# Altium project T-USB BQ10.PrjPcb (part 1 of 2)
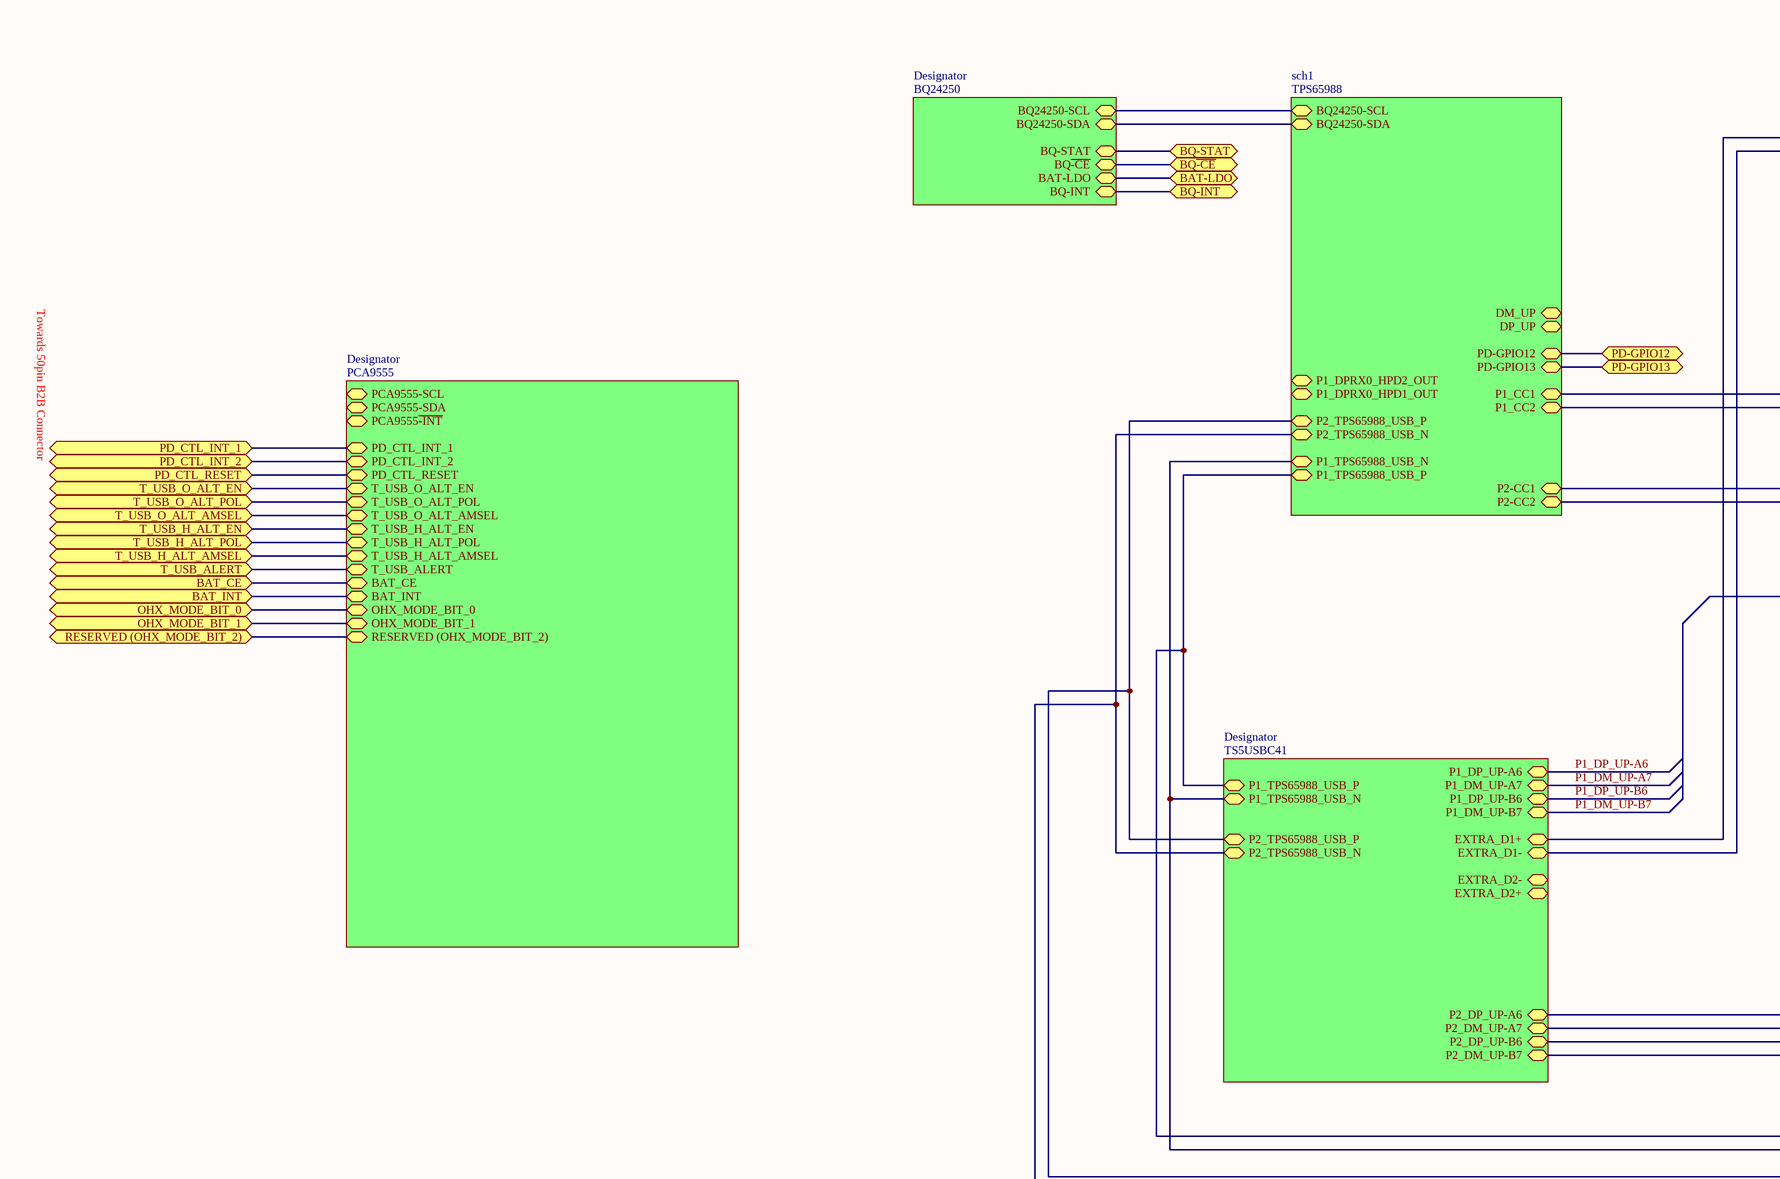
[diagram p0: System Block.SchDoc, top left]
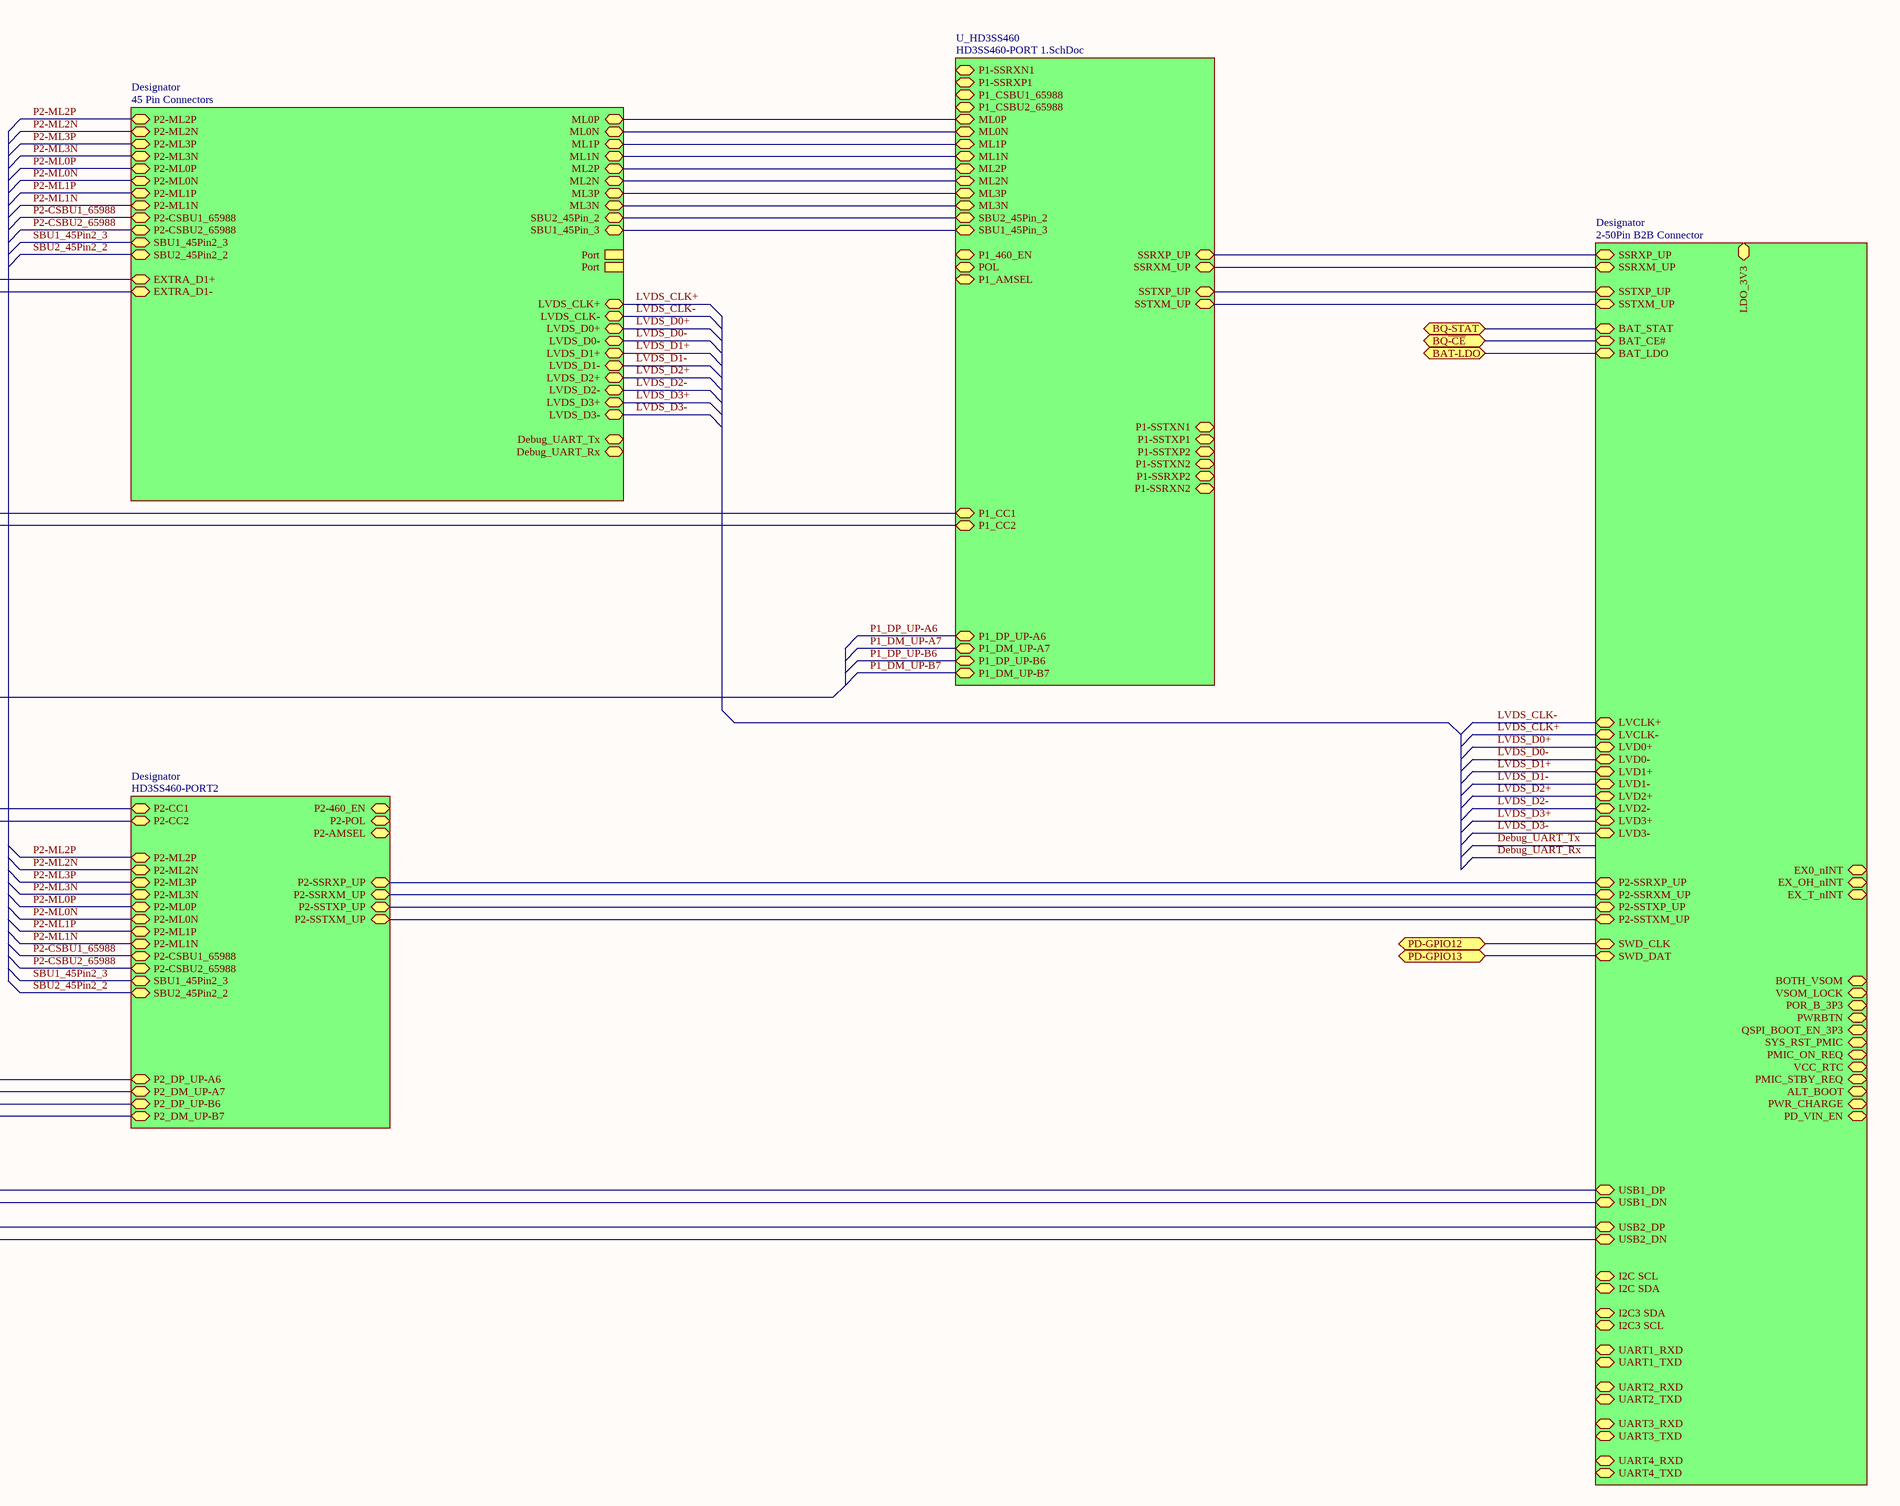
[diagram p1: System Block.SchDoc, top right]
Description: T-USB Board
9 sheets, 96 parts. Net scope: hierarchical (ports join the sheet entries above them; power ports are global).
Sheets:
  System Block.SchDoc
    sch1 = TPS65988.SchDoc
    U_HD3SS460 = HD3SS460-PORT 1.SchDoc
    Designator = TS5USBC41.SchDoc
    Designator = HD3SS460-PORT2.SchDoc
    Designator = BQ24250.SchDoc
    Designator = 2-50Pin B2B Connector.SchDoc
    Designator = 45 Pin Connectors.SchDoc
    Designator = PCA9555.SchDoc

## Sheet System Block.SchDoc
size A0; SheetNumber: 1; SheetTotal: 9

### Sub-sheets
Designator = TS5USBC41: P1_DM_UP-A7 (bidir), P1_DP_UP-A6 (bidir), P1_DP_UP-B6 (bidir), P1_DM_UP-B7 (bidir), P1_TPS65988_USB_P (bidir), P1_TPS65988_USB_N (bidir), P2_DP_UP-A6 (bidir), P2_DM_UP-A7 (bidir), P2_DP_UP-B6 (bidir), P2_DM_UP-B7 (bidir), P2_TPS65988_USB_P (bidir), P2_TPS65988_USB_N (bidir), EXTRA_D2+ (bidir), EXTRA_D2- (bidir), EXTRA_D1+ (bidir), EXTRA_D1- (bidir)
Designator = HD3SS460-PORT2: P2_DP_UP-A6 (bidir), P2-CSBU1_65988 (bidir), P2-AMSEL (bidir), P2-POL (bidir), P2-CSBU2_65988 (bidir), P2-CC1 (bidir), P2-CC2 (bidir), P2-SSTXP_UP (bidir), P2-SSTXM_UP (bidir), P2-SSRXM_UP (bidir), P2-SSRXP_UP (bidir), P2-ML2P (bidir), P2-ML2N (bidir), P2-ML3P (bidir), P2-ML3N (bidir), P2-ML0P (bidir), P2-ML0N (bidir), P2-460_EN (bidir), P2-ML1P (bidir), P2-ML1N (bidir), P2_DM_UP-A7 (bidir), P2_DP_UP-B6 (bidir), P2_DM_UP-B7 (bidir), SBU1_45Pin2_3 (bidir), SBU2_45Pin2_2 (bidir)
Designator = BQ24250: BQ-STAT (bidir), BQ~{-CE} (bidir), BQ-INT (bidir), BQ24250-SCL (bidir), BQ24250-SDA (bidir), BAT-LDO (bidir)
Designator = 2-50Pin B2B Connector: USB1_DN (bidir), USB1_DP (bidir), USB2_DP (bidir), USB2_DN (bidir), SWD_CLK (bidir), SWD_DAT (bidir), BOTH_VSOM (bidir), EX0_nINT (bidir), EX_T_nINT (bidir), EX_OH_nINT (bidir), VSOM_LOCK (bidir), SYS_RST_PMIC (bidir), PMIC_ON_REQ (bidir), POR_B_3P3 (bidir), PMIC_STBY_REQ (bidir), ALT_BOOT (bidir), PWRBTN (bidir), PWR_CHARGE (bidir), BAT_CE# (bidir), QSPI_BOOT_EN_3P3 (bidir), PD_VIN_EN (bidir), BAT_STAT (bidir), BAT_LDO (bidir), VCC_RTC (bidir), LDO_3V3 (bidir), I2C3 SDA (bidir), I2C3 SCL (bidir), LVD3- (bidir), LVD3+ (bidir), LVD2- (bidir), I2C SCL (bidir), I2C SDA (bidir), UART4_RXD (bidir), UART4_TXD (bidir), LVD2+ (bidir), UART3_RXD (bidir), LVD1+ (bidir), UART3_TXD (bidir), LVD1- (bidir), LVD0- (bidir), UART2_RXD (bidir), UART2_TXD (bidir), LVD0+ (bidir), UART1_TXD (bidir), UART1_RXD (bidir), LVCLK+ (bidir), LVCLK- (bidir), SSRXP_UP (bidir), SSRXM_UP (bidir), SSTXP_UP (bidir), SSTXM_UP (bidir), P2-SSRXP_UP (bidir), P2-SSRXM_UP (bidir), P2-SSTXP_UP (bidir), P2-SSTXM_UP (bidir)
Designator = 45 Pin Connectors: SBU2_45Pin_2 (bidir), SBU1_45Pin_3 (bidir), ML0N (bidir), ML0P (bidir), ML1P (bidir), ML1N (bidir), ML2P (bidir), ML2N (bidir), ML3P (bidir), ML3N (bidir), EXTRA_D1+ (bidir), Port, EXTRA_D1- (bidir), Port, LVDS_CLK- (bidir), LVDS_CLK+ (bidir), LVDS_D0+ (bidir), LVDS_D0- (bidir), LVDS_D1+ (bidir), LVDS_D1- (bidir), LVDS_D2+ (bidir), LVDS_D2- (bidir), LVDS_D3- (bidir), LVDS_D3+ (bidir), Debug_UART_Tx (bidir), Debug_UART_Rx (bidir), P2-ML2P (bidir), P2-ML2N (bidir), P2-ML3P (bidir), P2-ML3N (bidir), P2-ML0P (bidir), P2-ML0N (bidir), P2-ML1P (bidir), P2-ML1N (bidir), P2-CSBU1_65988 (bidir), P2-CSBU2_65988 (bidir), SBU1_45Pin2_3 (bidir), SBU2_45Pin2_2 (bidir)
Designator = PCA9555: PCA9555-SCL (bidir), PCA9555-SDA (bidir), PCA9555~{-INT} (bidir), PD_CTL_INT_1 (bidir), PD_CTL_INT_2 (bidir), PD_CTL_RESET (bidir), T_USB_O_ALT_EN (bidir), T_USB_O_ALT_POL (bidir), T_USB_O_ALT_AMSEL (bidir), T_USB_H_ALT_EN (bidir), T_USB_H_ALT_POL (bidir), T_USB_H_ALT_AMSEL (bidir), T_USB_ALERT (bidir), BAT_CE (bidir), BAT_INT (bidir), OHX_MODE_BIT_0 (bidir), OHX_MODE_BIT_1 (bidir), RESERVED (OHX_MODE_BIT_2) (bidir)
sch1 = TPS65988: DM_UP (bidir), DP_UP (bidir), P1_CC1 (bidir), P1_CC2 (bidir), P1_DPRX0_HPD1_OUT (bidir), P1_DPRX0_HPD2_OUT (bidir), P1_TPS65988_USB_P (bidir), P1_TPS65988_USB_N (bidir), P2_TPS65988_USB_P (bidir), P2_TPS65988_USB_N (bidir), P2-CC1 (bidir), P2-CC2 (bidir), BQ24250-SCL (bidir), BQ24250-SDA (bidir), PD-GPIO12 (bidir), PD-GPIO13 (bidir)
U_HD3SS460 = HD3SS460-PORT 1.SchDoc: P1_CC2 (bidir), P1_CSBU1_65988 (bidir), P1_CSBU2_65988 (bidir), P1_DM_UP-A7 (bidir), P1_DP_UP-A6 (bidir), POL (bidir), P1_AMSEL (bidir), P1_460_EN (bidir), ML1P (bidir), ML1N (bidir), ML0N (bidir), ML0P (bidir), ML3N (bidir), ML3P (bidir), ML2P (bidir), ML2N (bidir), SSTXM_UP (bidir), SSTXP_UP (bidir), SSRXP_UP (bidir), SSRXM_UP (bidir), P1_DP_UP-B6 (bidir), P1_DM_UP-B7 (bidir), P1-SSRXP1 (bidir), P1-SSRXN1 (bidir), P1-SSTXP1 (bidir), P1-SSTXN1 (bidir), P1-SSRXP2 (bidir), P1-SSRXN2 (bidir), P1-SSTXP2 (bidir), P1-SSTXN2 (bidir), SBU1_45Pin_3 (bidir), SBU2_45Pin_2 (bidir), P1_CC1 (bidir)

### Ports
BAT-LDO (bidir), BAT_CE (bidir), BAT_INT (bidir), BQ-INT (bidir), BQ-STAT (bidir), BQ~{-CE} (bidir), OHX_MODE_BIT_0 (bidir), OHX_MODE_BIT_1 (bidir), PD-GPIO12 (bidir), PD-GPIO13 (bidir), PD_CTL_INT_1 (bidir), PD_CTL_INT_2 (bidir), PD_CTL_RESET (bidir), RESERVED (OHX_MODE_BIT_2) (bidir), T_USB_ALERT (bidir), T_USB_H_ALT_AMSEL (bidir), T_USB_H_ALT_EN (bidir), T_USB_H_ALT_POL (bidir), T_USB_O_ALT_AMSEL (bidir), T_USB_O_ALT_EN (bidir), T_USB_O_ALT_POL (bidir)

### Nets
BQ24250-SCL: sheet sch1/BQ24250-SCL, sheet Designator/BQ24250-SCL
BQ24250-SDA: sheet sch1/BQ24250-SDA, sheet Designator/BQ24250-SDA
LDO: port BAT-LDO, sheet Designator/BAT-LDO, sheet Designator/BAT_LDO
LVDS_CLK+: sheet Designator/LVCLK-, sheet Designator/LVDS_CLK+
LVDS_CLK-: sheet Designator/LVCLK+, sheet Designator/LVDS_CLK-
LVDS_D0+: sheet Designator/LVD0+, sheet Designator/LVDS_D0+
LVDS_D0-: sheet Designator/LVD0-, sheet Designator/LVDS_D0-
LVDS_D1+: sheet Designator/LVD1+, sheet Designator/LVDS_D1+
LVDS_D1-: sheet Designator/LVD1-, sheet Designator/LVDS_D1-
LVDS_D2+: sheet Designator/LVD2+, sheet Designator/LVDS_D2+
LVDS_D2-: sheet Designator/LVD2-, sheet Designator/LVDS_D2-
LVDS_D3+: sheet Designator/LVD3+, sheet Designator/LVDS_D3+
LVDS_D3-: sheet Designator/LVD3-, sheet Designator/LVDS_D3-
P1_DM_UP-A7: sheet U_HD3SS460/P1_DM_UP-A7, sheet Designator/P1_DM_UP-A7
P1_DM_UP-B7: sheet U_HD3SS460/P1_DM_UP-B7, sheet Designator/P1_DM_UP-B7
P1_DP_UP-A6: sheet U_HD3SS460/P1_DP_UP-A6, sheet Designator/P1_DP_UP-A6  [project net DP_UP]
P1_DP_UP-B6: sheet U_HD3SS460/P1_DP_UP-B6, sheet Designator/P1_DP_UP-B6
P2-CSBU1_65988: sheet Designator/P2-CSBU1_65988, sheet Designator/P2-CSBU1_65988
P2-CSBU2_65988: sheet Designator/P2-CSBU2_65988, sheet Designator/P2-CSBU2_65988
P2-ML0N: sheet Designator/P2-ML0N, sheet Designator/P2-ML0N
P2-ML0P: sheet Designator/P2-ML0P, sheet Designator/P2-ML0P
P2-ML1N: sheet Designator/P2-ML1N, sheet Designator/P2-ML1N
P2-ML1P: sheet Designator/P2-ML1P, sheet Designator/P2-ML1P
P2-ML2N: sheet Designator/P2-ML2N, sheet Designator/P2-ML2N
P2-ML2P: sheet Designator/P2-ML2P, sheet Designator/P2-ML2P
P2-ML3N: sheet Designator/P2-ML3N, sheet Designator/P2-ML3N
P2-ML3P: sheet Designator/P2-ML3P, sheet Designator/P2-ML3P
SBU1_45Pin2_3: sheet Designator/SBU1_45Pin2_3, sheet Designator/SBU1_45Pin2_3
SBU1_460: sheet U_HD3SS460/SBU1_45Pin_3, sheet Designator/SBU1_45Pin_3
SBU2_45Pin2_2: sheet Designator/SBU2_45Pin2_2, sheet Designator/SBU2_45Pin2_2
SBU2_460: sheet U_HD3SS460/SBU2_45Pin_2, sheet Designator/SBU2_45Pin_2
NetIC1_24: sheet sch1/P1_CC1, sheet U_HD3SS460/P1_CC1
NetIC1_26: sheet sch1/P1_CC2, sheet U_HD3SS460/P1_CC2
NetIC1_40: port PD-GPIO12, sheet sch1/PD-GPIO12, sheet Designator/SWD_CLK
NetIC1_41: port PD-GPIO13, sheet sch1/PD-GPIO13, sheet Designator/SWD_DAT
NetIC1_45: sheet sch1/P2-CC1, sheet Designator/P2-CC1
NetIC1_47: sheet sch1/P2-CC2, sheet Designator/P2-CC2
NetIC2_16: sheet U_HD3SS460/ML1N, sheet Designator/ML1N
NetIC2_17: sheet U_HD3SS460/ML1P, sheet Designator/ML1P
NetIC2_19: sheet U_HD3SS460/ML0N, sheet Designator/ML0N
NetIC2_20: sheet U_HD3SS460/ML0P, sheet Designator/ML0P
NetIC2_21: sheet U_HD3SS460/ML3N, sheet Designator/ML3N
NetIC2_22: sheet U_HD3SS460/ML3P, sheet Designator/ML3P
NetIC2_24: sheet U_HD3SS460/ML2N, sheet Designator/ML2N
NetIC2_25: sheet U_HD3SS460/ML2P, sheet Designator/ML2P
NetIC2_26: sheet U_HD3SS460/SSTXP_UP, sheet Designator/SSTXP_UP
NetIC2_27: sheet U_HD3SS460/SSTXM_UP, sheet Designator/SSTXM_UP
NetIC2_29: sheet U_HD3SS460/SSRXP_UP, sheet Designator/SSRXP_UP
NetIC2_30: sheet U_HD3SS460/SSRXM_UP, sheet Designator/SSRXM_UP
NetIC3_C1: sheet sch1/P1_TPS65988_USB_P, sheet Designator/P1_TPS65988_USB_P, sheet Designator/USB1_DP
NetIC3_C2: sheet sch1/P1_TPS65988_USB_N, sheet Designator/P1_TPS65988_USB_N, sheet Designator/USB1_DN
NetIC3_C3: sheet Designator/EXTRA_D1+, sheet Designator/EXTRA_D1+
NetIC3_C4: sheet Designator/EXTRA_D1-, sheet Designator/EXTRA_D1-
NetIC4_A2: sheet Designator/P2_DP_UP-A6, sheet Designator/P2_DP_UP-A6
NetIC4_A3: sheet Designator/P2_DM_UP-A7, sheet Designator/P2_DM_UP-A7
NetIC4_C1: sheet sch1/P2_TPS65988_USB_P, sheet Designator/P2_TPS65988_USB_P, sheet Designator/USB2_DP
NetIC4_C2: sheet sch1/P2_TPS65988_USB_N, sheet Designator/P2_TPS65988_USB_N, sheet Designator/USB2_DN
NetIC6_A2: sheet Designator/P2_DP_UP-B6, sheet Designator/P2_DP_UP-B6
NetIC6_A3: sheet Designator/P2_DM_UP-B7, sheet Designator/P2_DM_UP-B7
NetIC7_26: sheet Designator/P2-SSTXP_UP, sheet Designator/P2-SSTXP_UP
NetIC7_27: sheet Designator/P2-SSTXM_UP, sheet Designator/P2-SSTXM_UP
NetIC7_29: sheet Designator/P2-SSRXP_UP, sheet Designator/P2-SSRXP_UP
NetIC7_30: sheet Designator/P2-SSRXM_UP, sheet Designator/P2-SSRXM_UP
NetIC8_1: port BQ~{-CE}, sheet Designator/BQ~{-CE}, sheet Designator/BAT_CE#
NetIC8_7: port BQ-STAT, sheet Designator/BQ-STAT, sheet Designator/BAT_STAT
NetIC8_8: port BQ-INT, sheet Designator/BQ-INT
NetIC9_4: port PD_CTL_INT_1, sheet Designator/PD_CTL_INT_1
NetIC9_5: port PD_CTL_INT_2, sheet Designator/PD_CTL_INT_2
NetIC9_6: port PD_CTL_RESET, sheet Designator/PD_CTL_RESET
NetIC9_7: port T_USB_O_ALT_EN, sheet Designator/T_USB_O_ALT_EN
NetIC9_8: port T_USB_O_ALT_POL, sheet Designator/T_USB_O_ALT_POL
NetIC9_9: port T_USB_O_ALT_AMSEL, sheet Designator/T_USB_O_ALT_AMSEL
NetIC9_10: port T_USB_H_ALT_EN, sheet Designator/T_USB_H_ALT_EN
NetIC9_11: port T_USB_H_ALT_POL, sheet Designator/T_USB_H_ALT_POL
NetIC9_14: port RESERVED (OHX_MODE_BIT_2), sheet Designator/RESERVED (OHX_MODE_BIT_2)
NetIC9_15: port OHX_MODE_BIT_1, sheet Designator/OHX_MODE_BIT_1
NetIC9_16: port OHX_MODE_BIT_0, sheet Designator/OHX_MODE_BIT_0
NetIC9_17: port BAT_INT, sheet Designator/BAT_INT
NetIC9_18: port BAT_CE, sheet Designator/BAT_CE
NetIC9_19: port T_USB_ALERT, sheet Designator/T_USB_ALERT
NetIC9_20: port T_USB_H_ALT_AMSEL, sheet Designator/T_USB_H_ALT_AMSEL
NetJ?#1_22: sheet Designator/Port, sheet Designator/Port

### Notes on the sheet
- Towards 50pin B2B Connector

## Sheet TPS65988.SchDoc
size A2; SheetNumber: 3; SheetTotal: 8
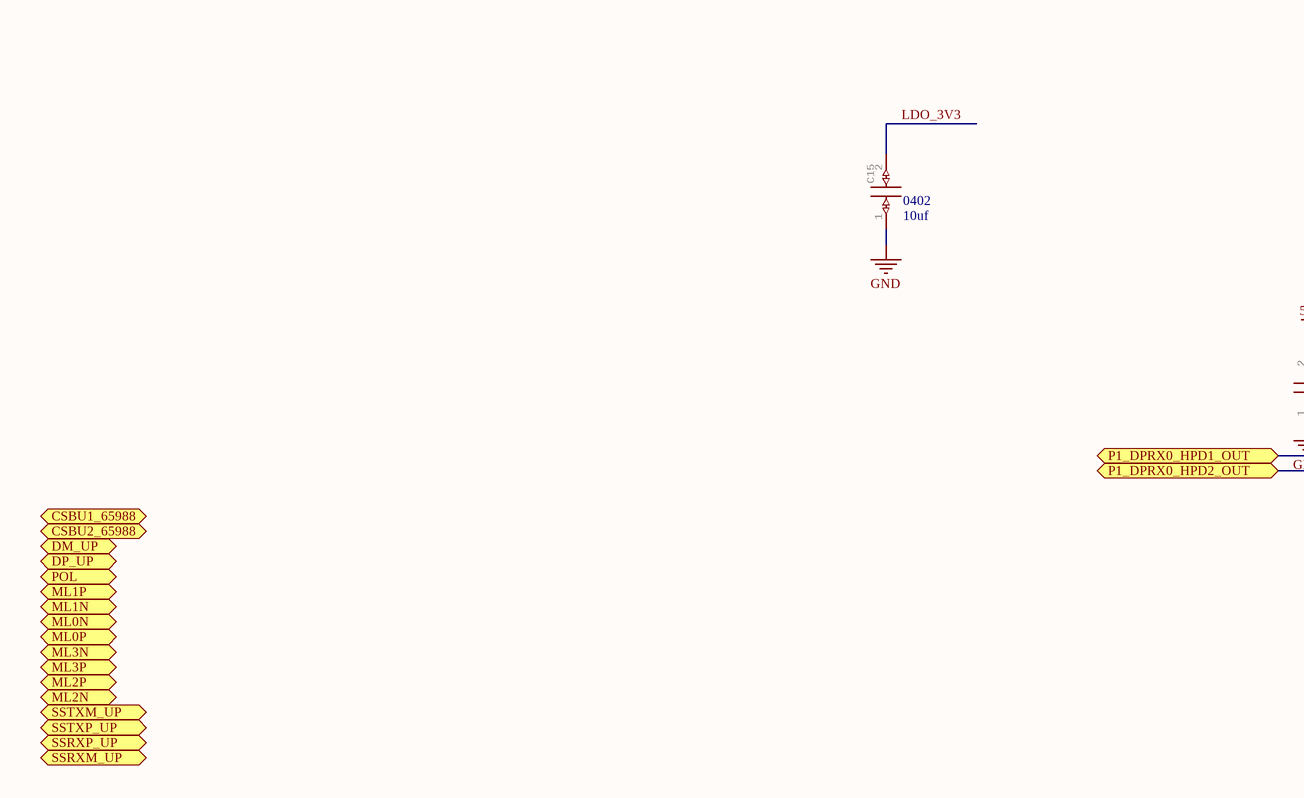
[diagram p2: TPS65988.SchDoc, left]
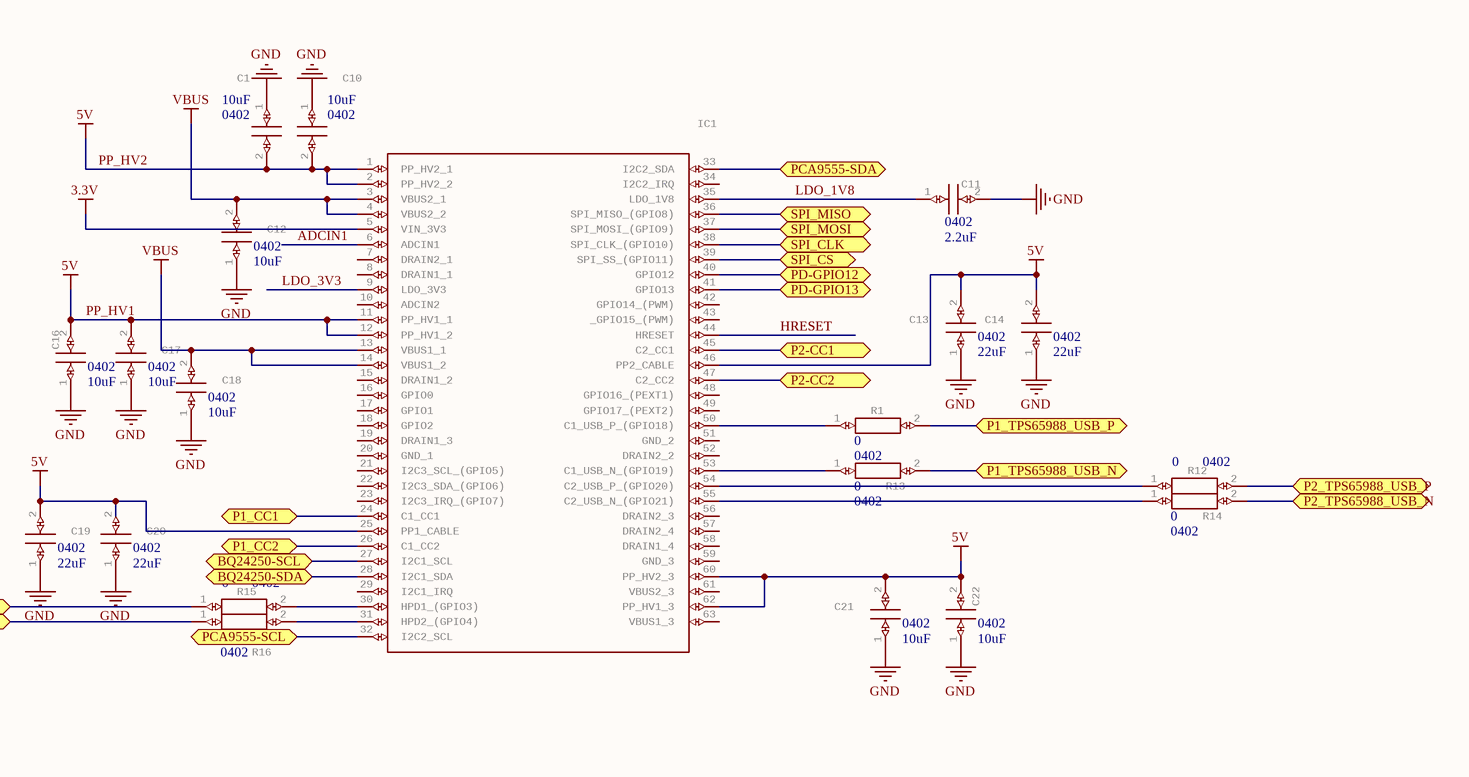
[diagram p3: TPS65988.SchDoc, right]

### Parts
C1  value 10uF  Package: 0402  [CAPC1005X56N]  (hidden comment: Multilayer Ceramic Capacitors MLCC - SMD/SMT 50V .1uF X7R 0402 10% Tol   Source:  Datasheet)
C10  value 10uF  Package: 0402  [CAPC1005X56N]  (hidden comment: Multilayer Ceramic Capacitors MLCC - SMD/SMT 50V .1uF X7R 0402 10% Tol   Source:  Datasheet)
C11  value 2.2uF  Package: 0402  [CAPC1005X56N]  (hidden comment: Multilayer Ceramic Capacitors MLCC - SMD/SMT 50V .1uF X7R 0402 10% Tol   Source:  Datasheet)
C12  value 10uF  Package: 0402  [CAPC1005X56N]  (hidden comment: Multilayer Ceramic Capacitors MLCC - SMD/SMT 50V .1uF X7R 0402 10% Tol   Source:  Datasheet)
C13  value 22uF  Package: 0402  [CAPC1005X56N]  (hidden comment: Multilayer Ceramic Capacitors MLCC - SMD/SMT 50V .1uF X7R 0402 10% Tol   Source:  Datasheet)
C14  value 22uF  Package: 0402  [CAPC1005X56N]  (hidden comment: Multilayer Ceramic Capacitors MLCC - SMD/SMT 50V .1uF X7R 0402 10% Tol   Source:  Datasheet)
C15  value 10uf  Package: 0402  [CAPC1005X56N]  (hidden comment: Multilayer Ceramic Capacitors MLCC - SMD/SMT 50V .1uF X7R 0402 10% Tol   Source:  Datasheet)
C16  value 10uF  Package: 0402  [CAPC1005X56N]  (hidden comment: Multilayer Ceramic Capacitors MLCC - SMD/SMT 50V .1uF X7R 0402 10% Tol   Source:  Datasheet)
C17  value 10uF  Package: 0402  [CAPC1005X56N]  (hidden comment: Multilayer Ceramic Capacitors MLCC - SMD/SMT 50V .1uF X7R 0402 10% Tol   Source:  Datasheet)
C18  value 10uF  Package: 0402  [CAPC1005X56N]  (hidden comment: Multilayer Ceramic Capacitors MLCC - SMD/SMT 50V .1uF X7R 0402 10% Tol   Source:  Datasheet)
C19  value 22uF  Package: 0402  [CAPC1005X56N]  (hidden comment: Multilayer Ceramic Capacitors MLCC - SMD/SMT 50V .1uF X7R 0402 10% Tol   Source:  Datasheet)
C20  value 22uF  Package: 0402  [CAPC1005X56N]  (hidden comment: Multilayer Ceramic Capacitors MLCC - SMD/SMT 50V .1uF X7R 0402 10% Tol   Source:  Datasheet)
C21  value 10uF  Package: 0402  [CAPC1005X56N]  (hidden comment: Multilayer Ceramic Capacitors MLCC - SMD/SMT 50V .1uF X7R 0402 10% Tol   Source:  Datasheet)
C22  value 10uF  Package: 0402  [CAPC1005X56N]  (hidden comment: Multilayer Ceramic Capacitors MLCC - SMD/SMT 50V .1uF X7R 0402 10% Tol   Source:  Datasheet)
IC1  Dual port USB Type-C and PD Controller with integrated power switches for PC & Thunderbolt systems   Source:  Datasheet  [TPS65988DJRSHR]  (value not drawn)
R1  value 0  Package: 0402  [RESC1005X40N]  (hidden comment: GENERAL PURPOSE CHIP RESISTORS   Source:  Datasheet)
R12  value 0  Package: 0402  [RESC1005X40N]  (hidden comment: GENERAL PURPOSE CHIP RESISTORS   Source:  Datasheet)
R13  value 0  Package: 0402  [RESC1005X40N]  (hidden comment: GENERAL PURPOSE CHIP RESISTORS   Source:  Datasheet)
R14  value 0  Package: 0402  [RESC1005X40N]  (hidden comment: GENERAL PURPOSE CHIP RESISTORS   Source:  Datasheet)
R15  value 0  Package: 0402  [RESC1005X40N]  (hidden comment: GENERAL PURPOSE CHIP RESISTORS   Source:  Datasheet)
R16  value 0  Package: 0402  [RESC1005X40N]  (hidden comment: GENERAL PURPOSE CHIP RESISTORS   Source:  Datasheet)

### Ports
BQ24250-SCL (bidir), BQ24250-SDA (bidir), CSBU1_65988 (bidir), CSBU2_65988 (bidir), DM_UP (bidir), DP_UP (bidir), ML0N (bidir), ML0P (bidir), ML1N (bidir), ML1P (bidir), ML2N (bidir), ML2P (bidir), ML3N (bidir), ML3P (bidir), P1_CC1 (bidir), P1_CC2 (bidir), P1_DPRX0_HPD1_OUT (bidir), P1_DPRX0_HPD2_OUT (bidir), P1_TPS65988_USB_N (bidir), P1_TPS65988_USB_P (bidir), P2-CC1 (bidir), P2-CC2 (bidir), P2_TPS65988_USB_N (bidir), P2_TPS65988_USB_P (bidir), PCA9555-SCL (bidir), PCA9555-SDA (bidir), PD-GPIO12 (bidir), PD-GPIO13 (bidir), POL (bidir), SPI_CLK (bidir), SPI_CS (bidir), SPI_MISO (bidir), SPI_MOSI (bidir), SSRXM_UP (bidir), SSRXP_UP (bidir), SSTXM_UP (bidir), SSTXP_UP (bidir)

### Nets
3.3V: IC1.5(VIN_3V3)
GND: C1.1 C10.1 C11.2 C12.1 C13.1 C14.1 C15.1 C16.1 C17.1 C18.1 C19.1 C20.1 C21.1 C22.1
PP_HV1: C1.2 C10.2 C13.2 C14.2 C16.2 C17.2 C19.2 C20.2 C21.2 C22.2 IC1.1(PP_HV2_1) IC1.2(PP_HV2_2) IC1.11(PP_HV1_1) IC1.12(PP_HV1_2) IC1.25(PP1_CABLE) IC1.46(PP2_CABLE) IC1.60(PP_HV2_3) IC1.62(PP_HV1_3)  [also labelled 5V, PP_HV2]
VBUS: C12.2 C18.2 IC1.3(VBUS2_1) IC1.4(VBUS2_2) IC1.13(VBUS1_1) IC1.14(VBUS1_2)
ADCIN1: IC1.6(ADCIN1)
BQ24250-SCL: IC1.27(I2C1_SCL) ; port BQ24250-SCL
BQ24250-SDA: IC1.28(I2C1_SDA) ; port BQ24250-SDA
HRESET: IC1.44(HRESET)
LDO_1V8: C11.1 IC1.35(LDO_1V8)
LDO_3V3: C15.2 IC1.9(LDO_3V3)
NetIC1_24: IC1.24(C1_CC1) ; port P1_CC1
NetIC1_26: IC1.26(C1_CC2) ; port P1_CC2
NetIC1_30: IC1.30(HPD1_(GPIO3)) R15.2
NetIC1_31: IC1.31(HPD2_(GPIO4)) R16.2
NetIC1_32: IC1.32(I2C2_SCL) ; port PCA9555-SCL
NetIC1_33: IC1.33(I2C2_SDA) ; port PCA9555-SDA
NetIC1_36: IC1.36(SPI_MISO_(GPIO8)) ; port SPI_MISO
NetIC1_37: IC1.37(SPI_MOSI_(GPIO9)) ; port SPI_MOSI
NetIC1_38: IC1.38(SPI_CLK_(GPIO10)) ; port SPI_CLK
NetIC1_39: IC1.39(SPI_SS_(GPIO11)) ; port SPI_CS
NetIC1_40: IC1.40(GPIO12) ; port PD-GPIO12
NetIC1_41: IC1.41(GPIO13) ; port PD-GPIO13
NetIC1_45: IC1.45(C2_CC1) ; port P2-CC1
NetIC1_47: IC1.47(C2_CC2) ; port P2-CC2
NetIC1_50: IC1.50(C1_USB_P_(GPIO18)) R1.1
NetIC1_53: IC1.53(C1_USB_N_(GPIO19)) R13.1
NetIC1_54: IC1.54(C2_USB_P_(GPIO20)) R12.1
NetIC1_55: IC1.55(C2_USB_N_(GPIO21)) R14.1
NetIC3_C1: R1.2 ; port P1_TPS65988_USB_P
NetIC3_C2: R13.2 ; port P1_TPS65988_USB_N
NetIC4_C1: R12.2 ; port P2_TPS65988_USB_P
NetIC4_C2: R14.2 ; port P2_TPS65988_USB_N
NetR15_1: R15.1 ; port P1_DPRX0_HPD1_OUT
NetR16_1: R16.1 ; port P1_DPRX0_HPD2_OUT

Not connected (* = marked no-connect by the designer): IC1 7(DRAIN2_1) 8(DRAIN1_1) 10(ADCIN2) 15(DRAIN1_2) 16(GPIO0) 17(GPIO1) 18(GPIO2) 19(DRAIN1_3) 20(GND_1) 21(I2C3_SCL_(GPIO5)) 22(I2C3_SDA_(GPIO6)) 23(I2C3_IRQ_(GPIO7)) 29(I2C1_IRQ) 34(I2C2_IRQ) 42(GPIO14_(PWM)) 43(_GPIO15_(PWM)) 48(GPIO16_(PEXT1)) 49(GPIO17_(PEXT2)) 51(GND_2) 52(DRAIN2_2) 56(DRAIN2_3) 57(DRAIN2_4) 58(DRAIN1_4) 59(GND_3) 61(VBUS2_3) 63(VBUS1_3)

### Library data of the parts
C1 C10-C22 = 04025C104KAT2A: Manufacturer_Name: AVX; GateName_1: G$1; SymbolName_1: 04025C104KAT2A; LibraryName: 04025C104KAT2A; DeviceSetName: 04025C104KAT2A; Manufacturer_Part_Number: 04025C104KAT2A; Mouser_Part_Number: 581-04025C104KAT2A; Mouser_Price-Stock: https://www.mouser.co.uk/ProductDetail/AVX/04025C104KAT2A?qs=ZBeOGGPQgEFYcwOskjAIVQ%3D%3D; Arrow_Part_Number: 04025C104KAT2A; Arrow_Price-Stock: https://www.arrow.com/en/products/04025c104kat2a/avx?region=nac; Height: 0.56mm
IC1 = TPS65988DJRSHR: Manufacturer_Name: Texas Instruments; GateName_1: G$1; SymbolName_1: TPS65988DJRSHR; LibraryName: TPS65988DJRSHR; DeviceSetName: TPS65988DJRSHR; Package: TPS65988DJRSHR; Manufacturer_Part_Number: TPS65988DJRSHR; Mouser_Part_Number: 595-TPS65988DJRSHR; Mouser_Price-Stock: https://www.mouser.co.uk/ProductDetail/Texas-Instruments/TPS65988DJRSHR?qs=T3oQrply3y8cml9f5FMm3A%3D%3D; Arrow_Part_Number: TPS65988DJRSHR; Arrow_Price-Stock: https://www.arrow.com/en/products/tps65988djrshr/texas-instruments; Height: 1mm
R1 R12-R16 = RC0402FR-071KL: Manufacturer_Name: KEMET; GateName_1: G$1; SymbolName_1: RC0402FR-071KL; LibraryName: RC0402FR-071KL; DeviceSetName: RC0402FR-071KL; Manufacturer_Part_Number: RC0402FR-071KL; Mouser_Part_Number: 603-RC0402FR-071KL; Mouser_Price-Stock: https://www.mouser.co.uk/ProductDetail/YAGEO/RC0402FR-071KL?qs=V1yeUXFNrknDEmWLmm5v6g%3D%3D; Arrow_Part_Number: RC0402FR-071KL; Arrow_Price-Stock: https://www.arrow.com/en/products/rc0402fr-071kl/yageo?region=nac; Height: 0.4mm

## Sheet HD3SS460-PORT 1.SchDoc
size A3; SheetNumber: 2; SheetTotal: 9
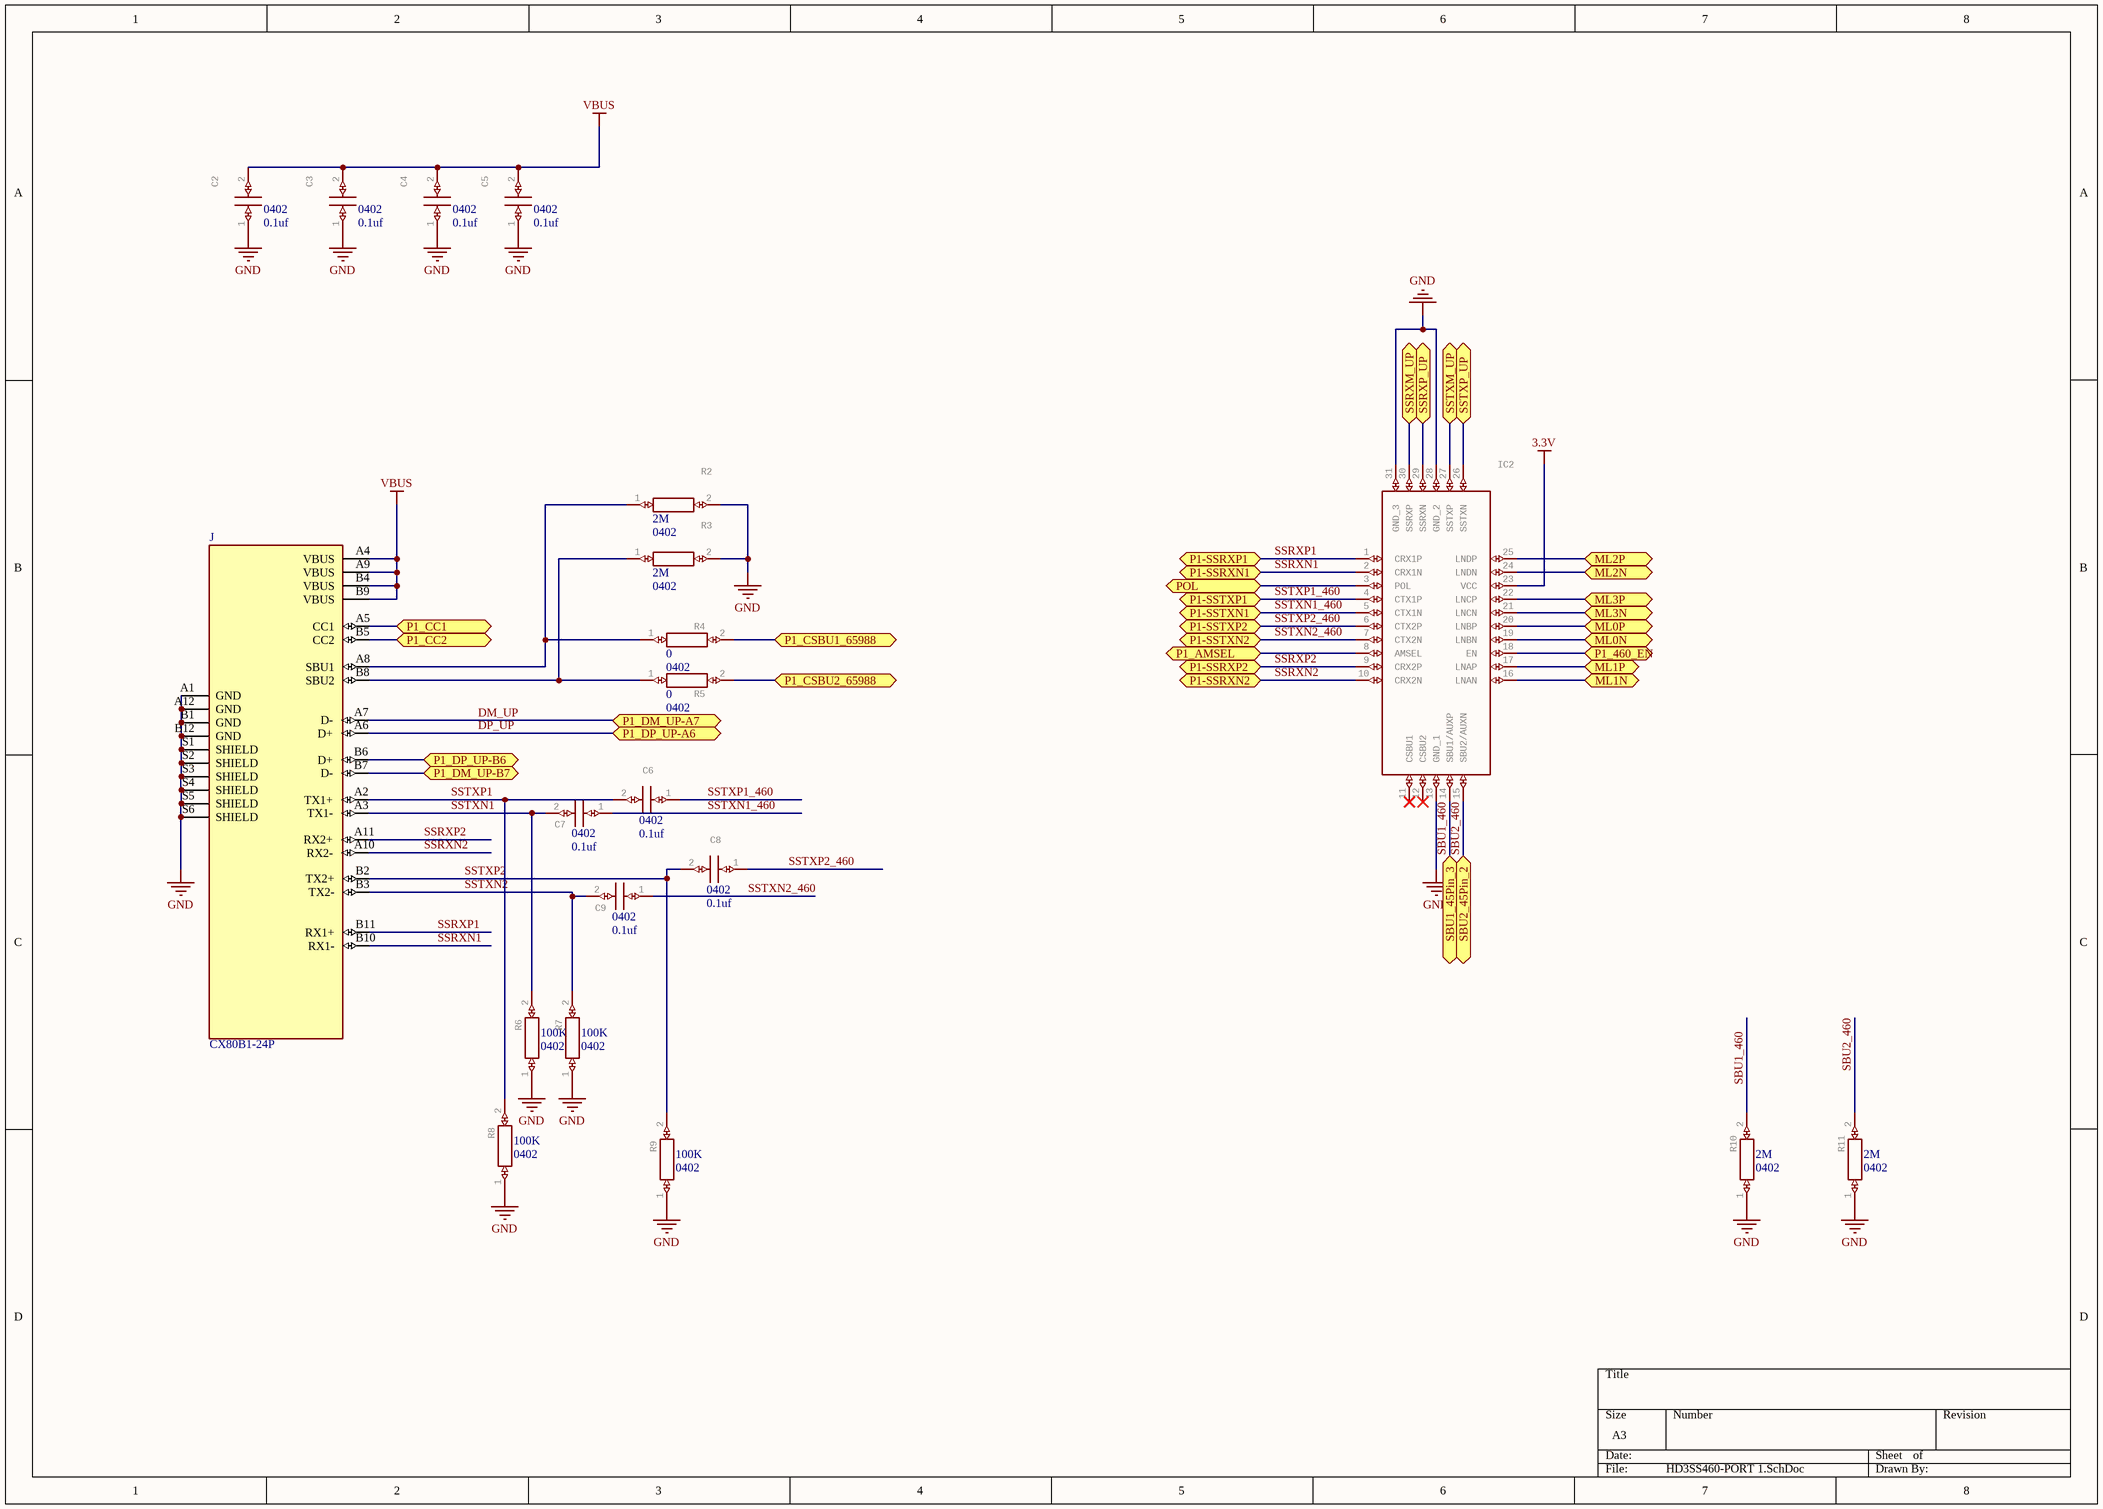
[diagram p4: HD3SS460-PORT 1.SchDoc]

### Parts
C2  value 0.1uf  Package: 0402  [CAPC1005X56N]  (hidden comment: Multilayer Ceramic Capacitors MLCC - SMD/SMT 50V .1uF X7R 0402 10% Tol   Source:  Datasheet)
C3  value 0.1uf  Package: 0402  [CAPC1005X56N]  (hidden comment: Multilayer Ceramic Capacitors MLCC - SMD/SMT 50V .1uF X7R 0402 10% Tol   Source:  Datasheet)
C4  value 0.1uf  Package: 0402  [CAPC1005X56N]  (hidden comment: Multilayer Ceramic Capacitors MLCC - SMD/SMT 50V .1uF X7R 0402 10% Tol   Source:  Datasheet)
C5  value 0.1uf  Package: 0402  [CAPC1005X56N]  (hidden comment: Multilayer Ceramic Capacitors MLCC - SMD/SMT 50V .1uF X7R 0402 10% Tol   Source:  Datasheet)
C6  value 0.1uf  Package: 0402  [CAPC1005X56N]  (hidden comment: Multilayer Ceramic Capacitors MLCC - SMD/SMT 50V .1uF X7R 0402 10% Tol   Source:  Datasheet)
C7  value 0.1uf  Package: 0402  [CAPC1005X56N]  (hidden comment: Multilayer Ceramic Capacitors MLCC - SMD/SMT 50V .1uF X7R 0402 10% Tol   Source:  Datasheet)
C8  value 0.1uf  Package: 0402  [CAPC1005X56N]  (hidden comment: Multilayer Ceramic Capacitors MLCC - SMD/SMT 50V .1uF X7R 0402 10% Tol   Source:  Datasheet)
C9  value 0.1uf  Package: 0402  [CAPC1005X56N]  (hidden comment: Multilayer Ceramic Capacitors MLCC - SMD/SMT 50V .1uF X7R 0402 10% Tol   Source:  Datasheet)
IC2  USB Type-C Alternate Mode 4x6 Differential Switch   Source:  Datasheet  [QFN40P250X450X80-31N]  (value not drawn)
J  CX80B1-24P  [HIROSE_CX80B1-24P]
R2  value 2M  Package: 0402  [RESC1005X40N]  (hidden comment: GENERAL PURPOSE CHIP RESISTORS   Source:  Datasheet)
R3  value 2M  Package: 0402  [RESC1005X40N]  (hidden comment: GENERAL PURPOSE CHIP RESISTORS   Source:  Datasheet)
R4  value 0  Package: 0402  [RESC1005X40N]  (hidden comment: GENERAL PURPOSE CHIP RESISTORS   Source:  Datasheet)
R5  value 0  Package: 0402  [RESC1005X40N]  (hidden comment: GENERAL PURPOSE CHIP RESISTORS   Source:  Datasheet)
R6  value 100K  Package: 0402  [RESC1005X40N]  (hidden comment: GENERAL PURPOSE CHIP RESISTORS   Source:  Datasheet)
R7  value 100K  Package: 0402  [RESC1005X40N]  (hidden comment: GENERAL PURPOSE CHIP RESISTORS   Source:  Datasheet)
R8  value 100K  Package: 0402  [RESC1005X40N]  (hidden comment: GENERAL PURPOSE CHIP RESISTORS   Source:  Datasheet)
R9  value 100K  Package: 0402  [RESC1005X40N]  (hidden comment: GENERAL PURPOSE CHIP RESISTORS   Source:  Datasheet)
R10  value 2M  Package: 0402  [RESC1005X40N]  (hidden comment: GENERAL PURPOSE CHIP RESISTORS   Source:  Datasheet)
R11  value 2M  Package: 0402  [RESC1005X40N]  (hidden comment: GENERAL PURPOSE CHIP RESISTORS   Source:  Datasheet)

### Ports
ML0N (bidir), ML0P (bidir), ML1N (bidir), ML1P (bidir), ML2N (bidir), ML2P (bidir), ML3N (bidir), ML3P (bidir), P1-SSRXN1 (bidir), P1-SSRXN2 (bidir), P1-SSRXP1 (bidir), P1-SSRXP2 (bidir), P1-SSTXN1 (bidir), P1-SSTXN2 (bidir), P1-SSTXP1 (bidir), P1-SSTXP2 (bidir), P1_460_EN (bidir), P1_AMSEL (bidir), P1_CC1 (bidir), P1_CC2 (bidir), P1_CSBU1_65988 (bidir), P1_CSBU2_65988 (bidir), P1_DM_UP-A7 (bidir), P1_DM_UP-B7 (bidir), P1_DP_UP-A6 (bidir), P1_DP_UP-B6 (bidir), POL (bidir), SBU1_45Pin_3 (bidir), SBU2_45Pin_2 (bidir), SSRXM_UP (bidir), SSRXP_UP (bidir), SSTXM_UP (bidir), SSTXP_UP (bidir)

### Nets
3.3V: IC2.23(VCC)
GND: C2.1 C3.1 C4.1 C5.1 IC2.13(GND_1) IC2.28(GND_2) IC2.31(GND_3) J.A1(GND) J.A12(GND) J.B1(GND) J.B12(GND) J.S1(SHIELD) J.S2(SHIELD) J.S3(SHIELD) J.S4(SHIELD) J.S5(SHIELD) J.S6(SHIELD) R2.2 R3.2 R6.1 R7.1 R8.1 R9.1 R10.1 R11.1
VBUS: C2.2 C3.2 C4.2 C5.2 J.A4(VBUS) J.A9(VBUS) J.B4(VBUS) J.B9(VBUS)
DP_UP: J.A6(D+) ; port P1_DP_UP-A6
P1_DM_UP-B7: J.B7(D-) ; port P1_DM_UP-B7
P1_DP_UP-B6: J.B6(D+) ; port P1_DP_UP-B6
SBU1_460: IC2.14(SBU1/AUXP) R10.2 ; port SBU1_45Pin_3
SBU2_460: IC2.15(SBU2/AUXN) R11.2 ; port SBU2_45Pin_2
SSRXN1: IC2.2(CRX1N) J.B10(RX1-) ; port P1-SSRXN1
SSRXN2: IC2.10(CRX2N) J.A10(RX2-) ; port P1-SSRXN2
SSRXP1: IC2.1(CRX1P) J.B11(RX1+) ; port P1-SSRXP1
SSRXP2: IC2.9(CRX2P) J.A11(RX2+) ; port P1-SSRXP2
SSTXN1: C7.2 J.A3(TX1-) R6.2
SSTXN1_460: C7.1 IC2.5(CTX1N) ; port P1-SSTXN1
SSTXN2: C9.2 J.B3(TX2-) R7.2
SSTXN2_460: C9.1 IC2.7(CTX2N) ; port P1-SSTXN2
SSTXP1: C6.2 J.A2(TX1+) R8.2
SSTXP1_460: C6.1 IC2.4(CTX1P) ; port P1-SSTXP1
SSTXP2: C8.2 J.B2(TX2+) R9.2
SSTXP2_460: C8.1 IC2.6(CTX2P) ; port P1-SSTXP2
NetIC1_24: J.A5(CC1) ; port P1_CC1
NetIC1_26: J.B5(CC2) ; port P1_CC2
NetIC2_3: IC2.3(POL) ; port POL
NetIC2_8: IC2.8(AMSEL) ; port P1_AMSEL
NetIC2_16: IC2.16(LNAN) ; port ML1N
NetIC2_17: IC2.17(LNAP) ; port ML1P
NetIC2_18: IC2.18(EN) ; port P1_460_EN
NetIC2_19: IC2.19(LNBN) ; port ML0N
NetIC2_20: IC2.20(LNBP) ; port ML0P
NetIC2_21: IC2.21(LNCN) ; port ML3N
NetIC2_22: IC2.22(LNCP) ; port ML3P
NetIC2_24: IC2.24(LNDN) ; port ML2N
NetIC2_25: IC2.25(LNDP) ; port ML2P
NetIC2_26: IC2.26(SSTXN) ; port SSTXP_UP
NetIC2_27: IC2.27(SSTXP) ; port SSTXM_UP
NetIC2_29: IC2.29(SSRXN) ; port SSRXP_UP
NetIC2_30: IC2.30(SSRXP) ; port SSRXM_UP
NetJ_A8: J.A8(SBU1) R2.1 R4.1
NetJ_B8: J.B8(SBU2) R3.1 R5.1
NetR4_2: R4.2 ; port P1_CSBU1_65988
NetR5_2: R5.2 ; port P1_CSBU2_65988

Not connected (* = marked no-connect by the designer): IC2 11(CSBU1)* 12(CSBU2)*; J A7(D-)

### Notes on the sheet
- Labels drawn without touching a wire or pin: DM_UP

### Library data of the parts
C2-C9 = 04025C104KAT2A: Manufacturer_Name: AVX; GateName_1: G$1; SymbolName_1: 04025C104KAT2A; LibraryName: 04025C104KAT2A; DeviceSetName: 04025C104KAT2A; Manufacturer_Part_Number: 04025C104KAT2A; Mouser_Part_Number: 581-04025C104KAT2A; Mouser_Price-Stock: https://www.mouser.co.uk/ProductDetail/AVX/04025C104KAT2A?qs=ZBeOGGPQgEFYcwOskjAIVQ%3D%3D; Arrow_Part_Number: 04025C104KAT2A; Arrow_Price-Stock: https://www.arrow.com/en/products/04025c104kat2a/avx?region=nac; Height: 0.56mm
IC2 = HD3SS460RNHR: Manufacturer_Name: Texas Instruments; GateName_1: G$1; SymbolName_1: HD3SS460RNHR; LibraryName: HD3SS460RNHR; DeviceSetName: HD3SS460RNHR; Package: QFN40P250X450X80-31N; Manufacturer_Part_Number: HD3SS460RNHR; Mouser_Part_Number: 595-HD3SS460RNHR; Mouser_Price-Stock: https://www.mouser.co.uk/ProductDetail/Texas-Instruments/HD3SS460RNHR?qs=6BVwEky2YVwfkjqmIesFTw%3D%3D; Arrow_Part_Number: HD3SS460RNHR; Arrow_Price-Stock: https://www.arrow.com/en/products/hd3ss460rnhr/texas-instruments; Height: 0.8mm
J = CX80B1-24P: USB-C _USB TYPE-C_ USB 3.1 _USB 3.1 Gen 2, Superspeed+_ Receptacle Connector 24 Position Surface Mount, Through Hole; MF: Hirose Electric Co Ltd; SnapEDA_Link: https://www.snapeda.com/parts/CX80B1-24P/Hirose%20Electric%20Co%20Ltd/view-part/3218887/?ref=snap; MP: CX80B1-24P; Package: None; Digi-Key_Part_Number: 26-CX80B1-24PCT-ND; Value: *; Digi-Key_Purchase_URL: https://www.digikey.com/product-detail/en/hirose-electric-co-ltd/CX80B1-24P/26-CX80B1-24PCT-ND/9816162?utm_source=snapeda&utm_medium=aggregator&utm_campaign=symbol
R2-R11 = RC0402FR-071KL: as R1 on sheet TPS65988; SymbolName_1: RC0402FR-071KL; LibraryName: RC0402FR-071KL; DeviceSetName: RC0402FR-071KL; Manufacturer_Part_Number: RC0402FR-071KL; Mouser_Part_Number: 603-RC0402FR-071KL; Mouser_Price-Stock: https://www.mouser.co.uk/ProductDetail/YAGEO/RC0402FR-071KL?qs=V1yeUXFNrknDEmWLmm5v6g%3D%3D; Arrow_Part_Number: RC0402FR-071KL; Arrow_Price-Stock: https://www.arrow.com/en/products/rc0402fr-071kl/yageo?region=nac; Height: 0.4mm

## Sheet TS5USBC41.SchDoc
size A4; SheetNumber: 4; SheetTotal: 8
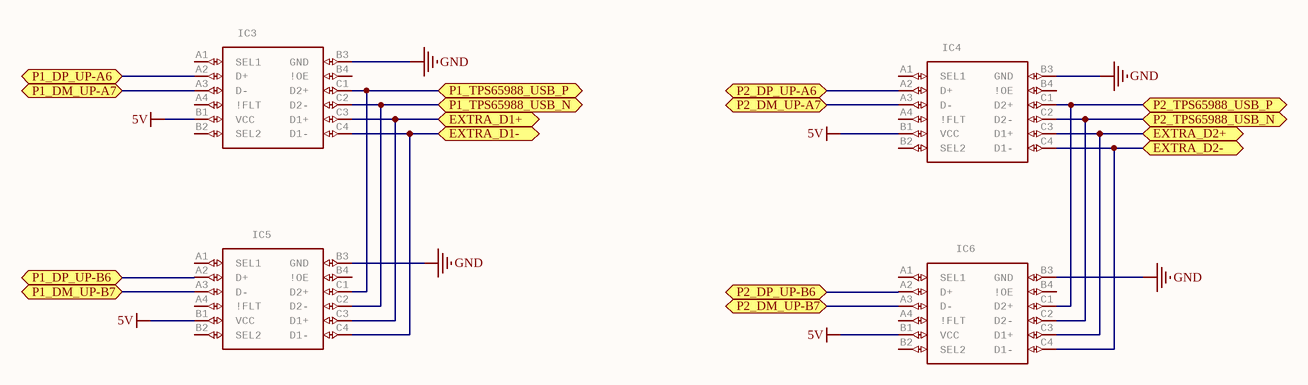
[diagram p5: TS5USBC41.SchDoc]

### Parts
IC3  Dual 2:1 USB 2.0 Mux/DeMux or Single Ended Cross Switch With 20-V/24-V OVP   Source:  Datasheet  [BGA12C40P4X3_160X120X62]  (value not drawn)
IC4  Dual 2:1 USB 2.0 Mux/DeMux or Single Ended Cross Switch With 20-V/24-V OVP   Source:  Datasheet  [BGA12C40P4X3_160X120X62]  (value not drawn)
IC5  Dual 2:1 USB 2.0 Mux/DeMux or Single Ended Cross Switch With 20-V/24-V OVP   Source:  Datasheet  [BGA12C40P4X3_160X120X62]  (value not drawn)
IC6  Dual 2:1 USB 2.0 Mux/DeMux or Single Ended Cross Switch With 20-V/24-V OVP   Source:  Datasheet  [BGA12C40P4X3_160X120X62]  (value not drawn)

### Ports
EXTRA_D1+ (bidir), EXTRA_D1- (bidir), EXTRA_D2+ (bidir), EXTRA_D2- (bidir), P1_DM_UP-A7 (bidir), P1_DM_UP-B7 (bidir), P1_DP_UP-A6 (bidir), P1_DP_UP-B6 (bidir), P1_TPS65988_USB_N (bidir), P1_TPS65988_USB_P (bidir), P2_DM_UP-A7 (bidir), P2_DM_UP-B7 (bidir), P2_DP_UP-A6 (bidir), P2_DP_UP-B6 (bidir), P2_TPS65988_USB_N (bidir), P2_TPS65988_USB_P (bidir)

### Nets
5V: IC3.B1(VCC) IC4.B1(VCC) IC5.B1(VCC) IC6.B1(VCC)  [project net PP_HV1]
GND: IC3.B3(GND) IC4.B3(GND) IC5.B3(GND) IC6.B3(GND)
DP_UP: IC3.A2(D+) ; port P1_DP_UP-A6
P1_DM_UP-A7: IC3.A3(D-) ; port P1_DM_UP-A7
P1_DM_UP-B7: IC5.A3(D-) ; port P1_DM_UP-B7
P1_DP_UP-B6: IC5.A2(D+) ; port P1_DP_UP-B6
NetIC3_C1: IC3.C1(D2+) IC5.C1(D2+) ; port P1_TPS65988_USB_P
NetIC3_C2: IC3.C2(D2-) IC5.C2(D2-) ; port P1_TPS65988_USB_N
NetIC3_C3: IC3.C3(D1+) IC5.C3(D1+) ; port EXTRA_D1+
NetIC3_C4: IC3.C4(D1-) IC5.C4(D1-) ; port EXTRA_D1-
NetIC4_A2: IC4.A2(D+) ; port P2_DP_UP-A6
NetIC4_A3: IC4.A3(D-) ; port P2_DM_UP-A7
NetIC4_C1: IC4.C1(D2+) IC6.C1(D2+) ; port P2_TPS65988_USB_P
NetIC4_C2: IC4.C2(D2-) IC6.C2(D2-) ; port P2_TPS65988_USB_N
NetIC4_C3: IC4.C3(D1+) IC6.C3(D1+) ; port EXTRA_D2+
NetIC4_C4: IC4.C4(D1-) IC6.C4(D1-) ; port EXTRA_D2-
NetIC6_A2: IC6.A2(D+) ; port P2_DP_UP-B6
NetIC6_A3: IC6.A3(D-) ; port P2_DM_UP-B7

Not connected (* = marked no-connect by the designer): IC3 A1(SEL1) A4(!FLT) B2(SEL2) B4(!OE); IC4 A1(SEL1) A4(!FLT) B2(SEL2) B4(!OE); IC5 A1(SEL1) A4(!FLT) B2(SEL2) B4(!OE); IC6 A1(SEL1) A4(!FLT) B2(SEL2) B4(!OE)

### Library data of the parts
IC3-IC6 = TS5USBC410IYFFR: Manufacturer_Name: Texas Instruments; GateName_1: G$1; SymbolName_1: TS5USBC410IYFFR; LibraryName: TS5USBC410IYFFR; DeviceSetName: TS5USBC410IYFFR; Package: BGA12C40P4X3_160X120X62; Manufacturer_Part_Number: TS5USBC410IYFFR; Mouser_Part_Number: 595-TS5USBC410IYFFR; Mouser_Price-Stock: https://www.mouser.co.uk/ProductDetail/Texas-Instruments/TS5USBC410IYFFR?qs=F5EMLAvA7IAhys8Eb8O2UQ%3D%3D; Arrow_Part_Number: TS5USBC410IYFFR; Arrow_Price-Stock: https://www.arrow.com/en/products/ts5usbc410iyffr/texas-instruments?region=nac; Height: 0.625mm

## Sheet HD3SS460-PORT2.SchDoc
size A3; SheetNumber: 5; SheetTotal: 9
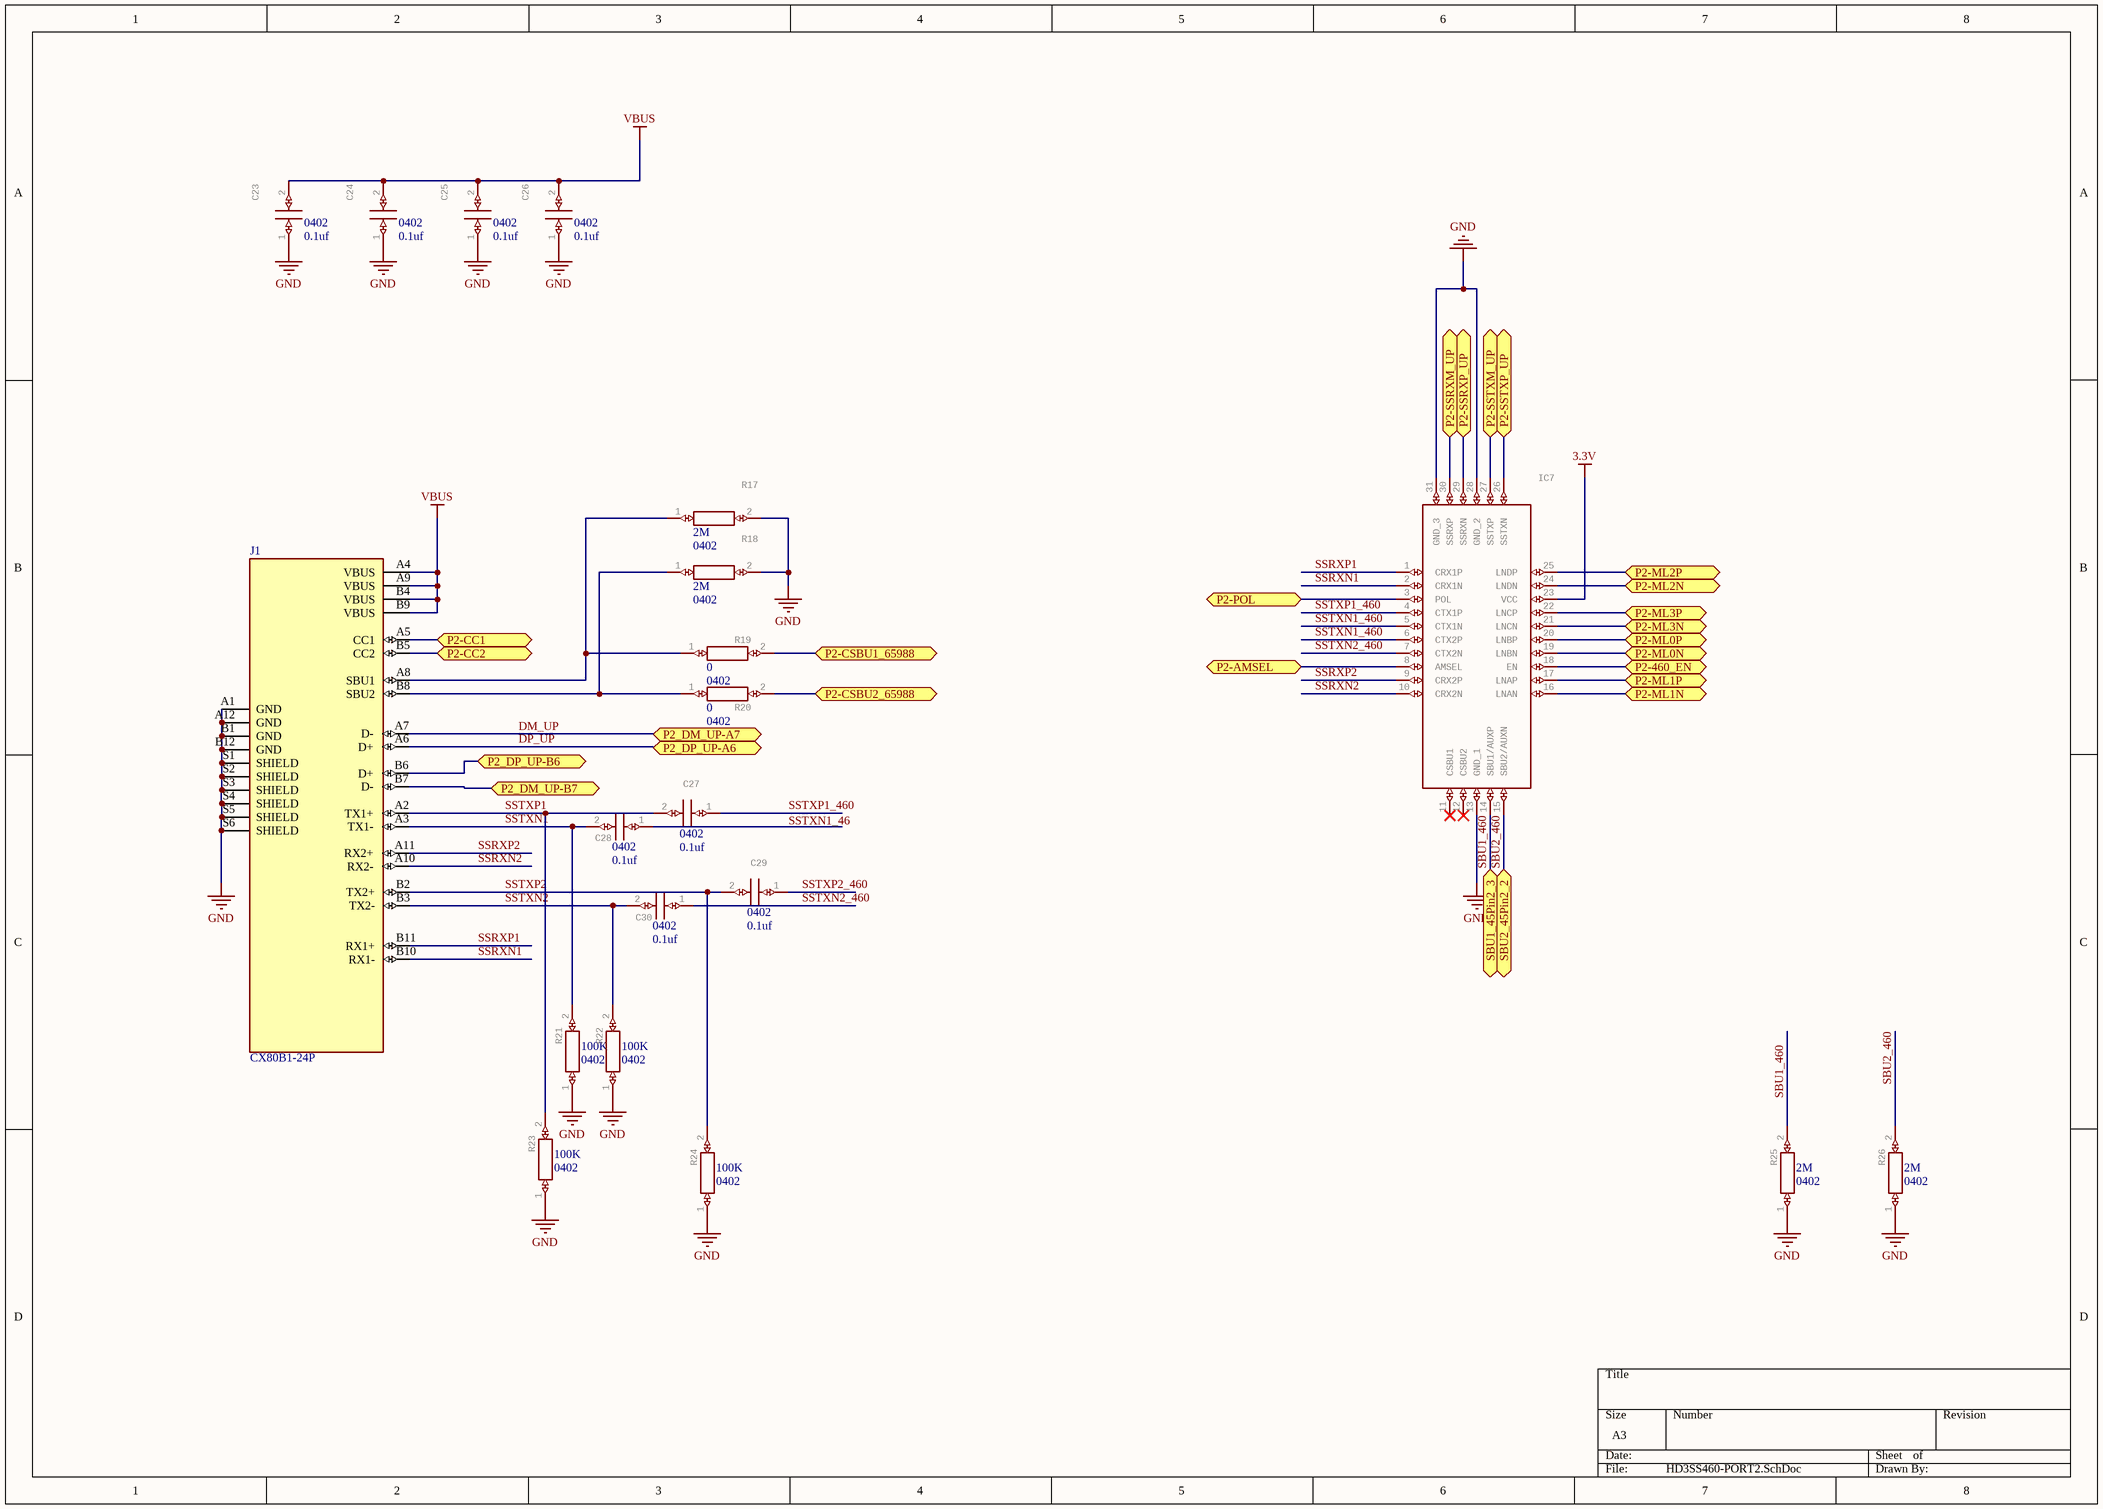
[diagram p6: HD3SS460-PORT2.SchDoc]

### Parts
C23  value 0.1uf  Package: 0402  [CAPC1005X56N]  (hidden comment: Multilayer Ceramic Capacitors MLCC - SMD/SMT 50V .1uF X7R 0402 10% Tol   Source:  Datasheet)
C24  value 0.1uf  Package: 0402  [CAPC1005X56N]  (hidden comment: Multilayer Ceramic Capacitors MLCC - SMD/SMT 50V .1uF X7R 0402 10% Tol   Source:  Datasheet)
C25  value 0.1uf  Package: 0402  [CAPC1005X56N]  (hidden comment: Multilayer Ceramic Capacitors MLCC - SMD/SMT 50V .1uF X7R 0402 10% Tol   Source:  Datasheet)
C26  value 0.1uf  Package: 0402  [CAPC1005X56N]  (hidden comment: Multilayer Ceramic Capacitors MLCC - SMD/SMT 50V .1uF X7R 0402 10% Tol   Source:  Datasheet)
C27  value 0.1uf  Package: 0402  [CAPC1005X56N]  (hidden comment: Multilayer Ceramic Capacitors MLCC - SMD/SMT 50V .1uF X7R 0402 10% Tol   Source:  Datasheet)
C28  value 0.1uf  Package: 0402  [CAPC1005X56N]  (hidden comment: Multilayer Ceramic Capacitors MLCC - SMD/SMT 50V .1uF X7R 0402 10% Tol   Source:  Datasheet)
C29  value 0.1uf  Package: 0402  [CAPC1005X56N]  (hidden comment: Multilayer Ceramic Capacitors MLCC - SMD/SMT 50V .1uF X7R 0402 10% Tol   Source:  Datasheet)
C30  value 0.1uf  Package: 0402  [CAPC1005X56N]  (hidden comment: Multilayer Ceramic Capacitors MLCC - SMD/SMT 50V .1uF X7R 0402 10% Tol   Source:  Datasheet)
IC7  USB Type-C Alternate Mode 4x6 Differential Switch   Source:  Datasheet  [QFN40P250X450X80-31N]  (value not drawn)
J1  CX80B1-24P  [HIROSE_CX80B1-24P]
R17  value 2M  Package: 0402  [RESC1005X40N]  (hidden comment: GENERAL PURPOSE CHIP RESISTORS   Source:  Datasheet)
R18  value 2M  Package: 0402  [RESC1005X40N]  (hidden comment: GENERAL PURPOSE CHIP RESISTORS   Source:  Datasheet)
R19  value 0  Package: 0402  [RESC1005X40N]  (hidden comment: GENERAL PURPOSE CHIP RESISTORS   Source:  Datasheet)
R20  value 0  Package: 0402  [RESC1005X40N]  (hidden comment: GENERAL PURPOSE CHIP RESISTORS   Source:  Datasheet)
R21  value 100K  Package: 0402  [RESC1005X40N]  (hidden comment: GENERAL PURPOSE CHIP RESISTORS   Source:  Datasheet)
R22  value 100K  Package: 0402  [RESC1005X40N]  (hidden comment: GENERAL PURPOSE CHIP RESISTORS   Source:  Datasheet)
R23  value 100K  Package: 0402  [RESC1005X40N]  (hidden comment: GENERAL PURPOSE CHIP RESISTORS   Source:  Datasheet)
R24  value 100K  Package: 0402  [RESC1005X40N]  (hidden comment: GENERAL PURPOSE CHIP RESISTORS   Source:  Datasheet)
R25  value 2M  Package: 0402  [RESC1005X40N]  (hidden comment: GENERAL PURPOSE CHIP RESISTORS   Source:  Datasheet)
R26  value 2M  Package: 0402  [RESC1005X40N]  (hidden comment: GENERAL PURPOSE CHIP RESISTORS   Source:  Datasheet)

### Ports
P2-460_EN (bidir), P2-AMSEL (bidir), P2-CC1 (bidir), P2-CC2 (bidir), P2-CSBU1_65988 (bidir), P2-CSBU2_65988 (bidir), P2-ML0N (bidir), P2-ML0P (bidir), P2-ML1N (bidir), P2-ML1P (bidir), P2-ML2N (bidir), P2-ML2P (bidir), P2-ML3N (bidir), P2-ML3P (bidir), P2-POL (bidir), P2-SSRXM_UP (bidir), P2-SSRXP_UP (bidir), P2-SSTXM_UP (bidir), P2-SSTXP_UP (bidir), P2_DM_UP-A7 (bidir), P2_DM_UP-B7 (bidir), P2_DP_UP-A6 (bidir), P2_DP_UP-B6 (bidir), SBU1_45Pin2_3 (bidir), SBU2_45Pin2_2 (bidir)

### Nets
3.3V: IC7.23(VCC)
GND: C23.1 C24.1 C25.1 C26.1 IC7.13(GND_1) IC7.28(GND_2) IC7.31(GND_3) J1.A1(GND) J1.A12(GND) J1.B1(GND) J1.B12(GND) J1.S1(SHIELD) J1.S2(SHIELD) J1.S3(SHIELD) J1.S4(SHIELD) J1.S5(SHIELD) J1.S6(SHIELD) R17.2 R18.2 R21.1 R22.1 R23.1 R24.1 R25.1 R26.1
VBUS: C23.2 C24.2 C25.2 C26.2 J1.A4(VBUS) J1.A9(VBUS) J1.B4(VBUS) J1.B9(VBUS)
DP_UP: J1.A6(D+)
P2-CSBU1_65988: R19.2 ; port P2-CSBU1_65988
P2-CSBU2_65988: R20.2 ; port P2-CSBU2_65988
P2-ML0N: IC7.19(LNBN) ; port P2-ML0N
P2-ML0P: IC7.20(LNBP) ; port P2-ML0P
P2-ML1N: IC7.16(LNAN) ; port P2-ML1N
P2-ML1P: IC7.17(LNAP) ; port P2-ML1P
P2-ML2N: IC7.24(LNDN) ; port P2-ML2N
P2-ML2P: IC7.25(LNDP) ; port P2-ML2P
P2-ML3N: IC7.21(LNCN) ; port P2-ML3N
P2-ML3P: IC7.22(LNCP) ; port P2-ML3P
SBU1_460: IC7.14(SBU1/AUXP) R25.2 ; port SBU1_45Pin2_3  [project net SBU1_45Pin2_3]
SBU2_460: IC7.15(SBU2/AUXN) R26.2 ; port SBU2_45Pin2_2  [project net SBU2_45Pin2_2]
SSRXN1: IC7.2(CRX1N) J1.B10(RX1-)
SSRXN2: IC7.10(CRX2N) J1.A10(RX2-)
SSRXP1: IC7.1(CRX1P) J1.B11(RX1+)
SSRXP2: IC7.9(CRX2P) J1.A11(RX2+)
SSTXN1: C28.2 J1.A3(TX1-) R21.2
SSTXN1_460: IC7.5(CTX1N) IC7.6(CTX2P)
SSTXN2: C30.2 J1.B3(TX2-) R22.2
SSTXN2_460: C30.1 IC7.7(CTX2N)
SSTXP1: C27.2 J1.A2(TX1+) R23.2
SSTXP1_460: C27.1 IC7.4(CTX1P)
SSTXP2: C29.2 J1.B2(TX2+) R24.2
SSTXP2_460: C29.1
NetIC1_45: J1.A5(CC1) ; port P2-CC1
NetIC1_47: J1.B5(CC2) ; port P2-CC2
NetIC6_A2: J1.B6(D+) ; port P2_DP_UP-B6
NetIC6_A3: J1.B7(D-) ; port P2_DM_UP-B7
NetIC7_3: IC7.3(POL) ; port P2-POL
NetIC7_8: IC7.8(AMSEL) ; port P2-AMSEL
NetIC7_18: IC7.18(EN) ; port P2-460_EN
NetIC7_26: IC7.26(SSTXN) ; port P2-SSTXP_UP
NetIC7_27: IC7.27(SSTXP) ; port P2-SSTXM_UP
NetIC7_29: IC7.29(SSRXN) ; port P2-SSRXP_UP
NetIC7_30: IC7.30(SSRXP) ; port P2-SSRXM_UP
NetJ1_A8: J1.A8(SBU1) R17.1 R19.1
NetJ1_B8: J1.B8(SBU2) R18.1 R20.1

Not connected (* = marked no-connect by the designer): C28 1; IC7 11(CSBU1)* 12(CSBU2)*; J1 A7(D-)

### Notes on the sheet
- Labels drawn without touching a wire or pin: DM_UP, SSTXN1_46

### Library data of the parts
C23-C30 = 04025C104KAT2A: Manufacturer_Name: AVX; GateName_1: G$1; SymbolName_1: 04025C104KAT2A; LibraryName: 04025C104KAT2A; DeviceSetName: 04025C104KAT2A; Manufacturer_Part_Number: 04025C104KAT2A; Mouser_Part_Number: 581-04025C104KAT2A; Mouser_Price-Stock: https://www.mouser.co.uk/ProductDetail/AVX/04025C104KAT2A?qs=ZBeOGGPQgEFYcwOskjAIVQ%3D%3D; Arrow_Part_Number: 04025C104KAT2A; Arrow_Price-Stock: https://www.arrow.com/en/products/04025c104kat2a/avx?region=nac; Height: 0.56mm
IC7 = HD3SS460RNHR: as IC2 on sheet HD3SS460-PORT 1; SymbolName_1: HD3SS460RNHR; LibraryName: HD3SS460RNHR; DeviceSetName: HD3SS460RNHR; Package: QFN40P250X450X80-31N; Manufacturer_Part_Number: HD3SS460RNHR; Mouser_Part_Number: 595-HD3SS460RNHR; Mouser_Price-Stock: https://www.mouser.co.uk/ProductDetail/Texas-Instruments/HD3SS460RNHR?qs=6BVwEky2YVwfkjqmIesFTw%3D%3D; Arrow_Part_Number: HD3SS460RNHR; Arrow_Price-Stock: https://www.arrow.com/en/products/hd3ss460rnhr/texas-instruments; Height: 0.8mm
J1 = CX80B1-24P: as J on sheet HD3SS460-PORT 1; SnapEDA_Link: https://www.snapeda.com/parts/CX80B1-24P/Hirose%20Electric%20Co%20Ltd/view-part/3218887/?ref=snap; MP: CX80B1-24P; Package: None; Digi-Key_Part_Number: 26-CX80B1-24PCT-ND; Value: *; Digi-Key_Purchase_URL: https://www.digikey.com/product-detail/en/hirose-electric-co-ltd/CX80B1-24P/26-CX80B1-24PCT-ND/9816162?utm_source=snapeda&utm_medium=aggregator&utm_campaign=symbol
R17-R26 = RC0402FR-071KL: as R1 on sheet TPS65988; SymbolName_1: RC0402FR-071KL; LibraryName: RC0402FR-071KL; DeviceSetName: RC0402FR-071KL; Manufacturer_Part_Number: RC0402FR-071KL; Mouser_Part_Number: 603-RC0402FR-071KL; Mouser_Price-Stock: https://www.mouser.co.uk/ProductDetail/YAGEO/RC0402FR-071KL?qs=V1yeUXFNrknDEmWLmm5v6g%3D%3D; Arrow_Part_Number: RC0402FR-071KL; Arrow_Price-Stock: https://www.arrow.com/en/products/rc0402fr-071kl/yageo?region=nac; Height: 0.4mm

## Sheet BQ24250.SchDoc
size A3; SheetNumber: 6; SheetTotal: 8
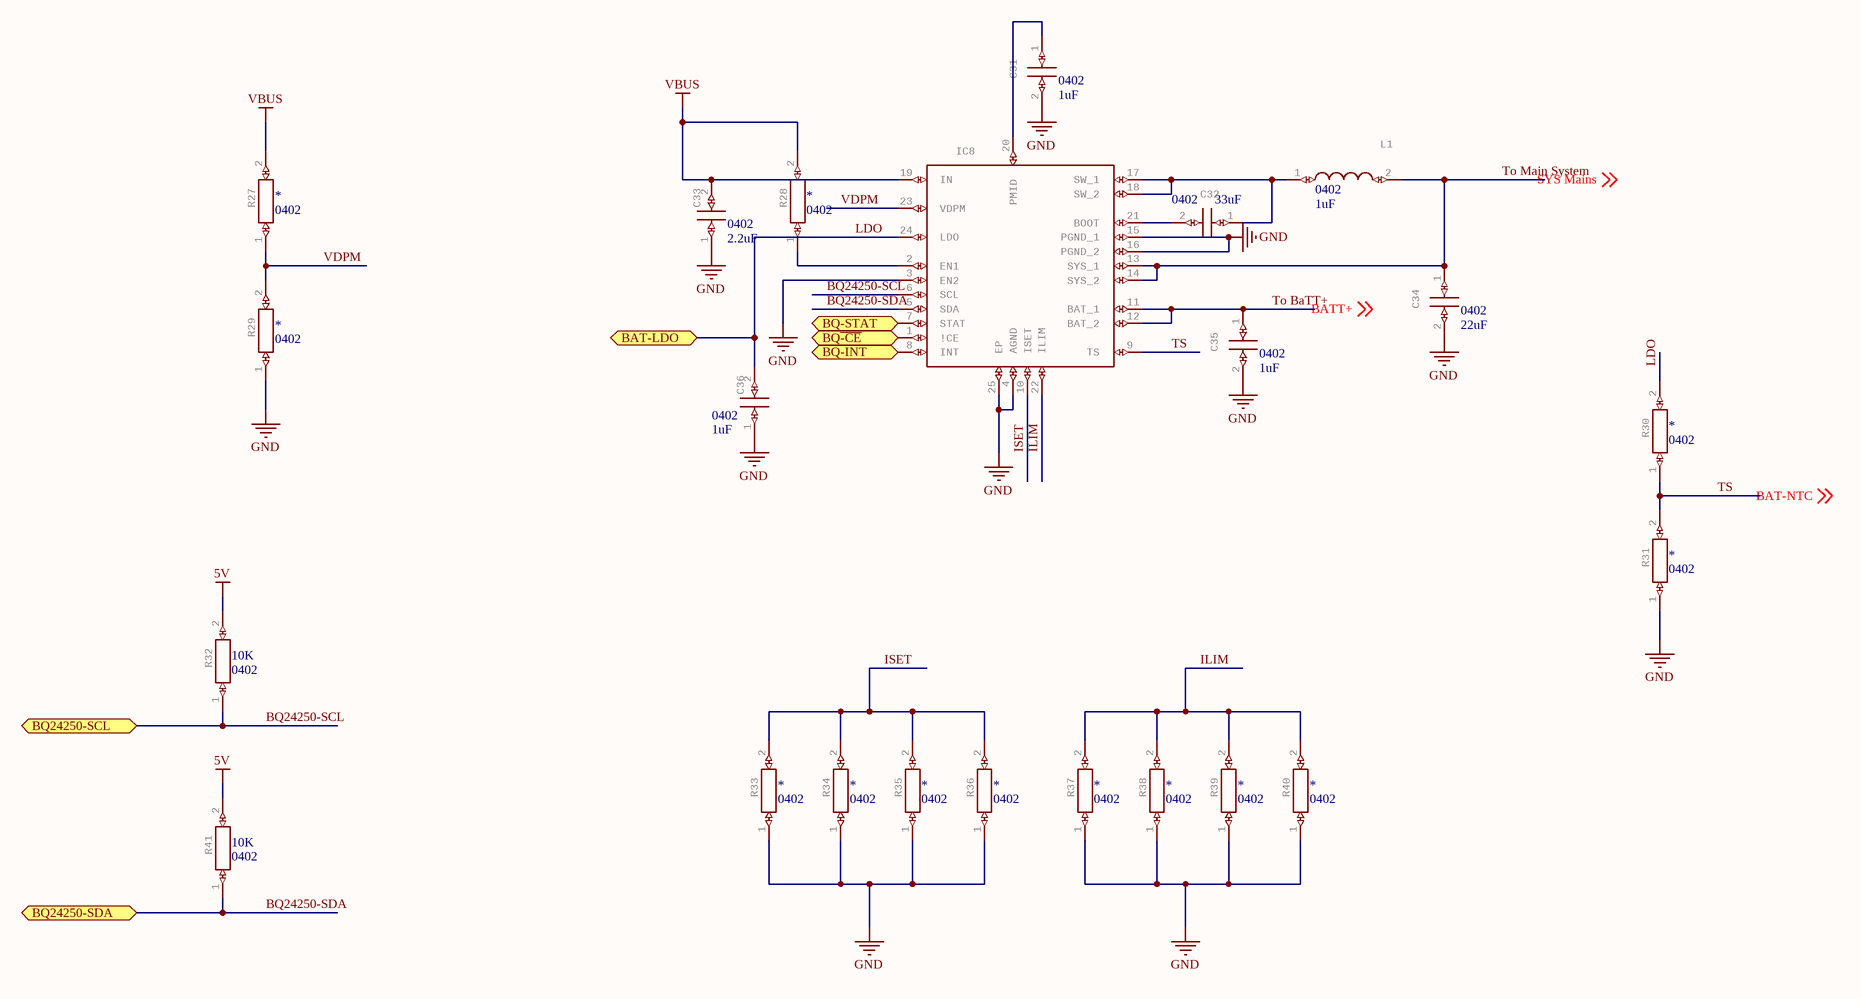
[diagram p7: BQ24250.SchDoc]

### Parts
C31  value 1uF  Package: 0402  [CAPC1005X56N]  (hidden comment: Multilayer Ceramic Capacitors MLCC - SMD/SMT 50V .1uF X7R 0402 10% Tol   Source:  Datasheet)
C32  value 33uF  Package: 0402  [CAPC1005X56N]  (hidden comment: Multilayer Ceramic Capacitors MLCC - SMD/SMT 50V .1uF X7R 0402 10% Tol   Source:  Datasheet)
C33  value 2.2uF  Package: 0402  [CAPC1005X56N]  (hidden comment: Multilayer Ceramic Capacitors MLCC - SMD/SMT 50V .1uF X7R 0402 10% Tol   Source:  Datasheet)
C34  value 22uF  Package: 0402  [CAPC1005X56N]  (hidden comment: Multilayer Ceramic Capacitors MLCC - SMD/SMT 50V .1uF X7R 0402 10% Tol   Source:  Datasheet)
C35  value 1uF  Package: 0402  [CAPC1005X56N]  (hidden comment: Multilayer Ceramic Capacitors MLCC - SMD/SMT 50V .1uF X7R 0402 10% Tol   Source:  Datasheet)
C36  value 1uF  Package: 0402  [CAPC1005X56N]  (hidden comment: Multilayer Ceramic Capacitors MLCC - SMD/SMT 50V .1uF X7R 0402 10% Tol   Source:  Datasheet)
IC8  2A Single Input I2C/Standalone Switch-Mode Li-Ion Battery Charger   Source:  Datasheet  [QFN50P400X400X100-25N]  (value not drawn)
L1  value 1uF  Package: 0402  [INDC1005X55N]  (hidden comment: Fixed Inductors INDUCTOR,MCOIL HIGH CURRENT,1.0UH 20% ,T&R   Source:  Datasheet)
R27  Package: 0402  [RESC1005X40N]  (hidden comment: GENERAL PURPOSE CHIP RESISTORS   Source:  Datasheet)
R28  Package: 0402  [RESC1005X40N]  (hidden comment: GENERAL PURPOSE CHIP RESISTORS   Source:  Datasheet)
R29  Package: 0402  [RESC1005X40N]  (hidden comment: GENERAL PURPOSE CHIP RESISTORS   Source:  Datasheet)
R30  Package: 0402  [RESC1005X40N]  (hidden comment: GENERAL PURPOSE CHIP RESISTORS   Source:  Datasheet)
R31  Package: 0402  [RESC1005X40N]  (hidden comment: GENERAL PURPOSE CHIP RESISTORS   Source:  Datasheet)
R32  value 10K  Package: 0402  [RESC1005X40N]  (hidden comment: GENERAL PURPOSE CHIP RESISTORS   Source:  Datasheet)
R33  Package: 0402  [RESC1005X40N]  (hidden comment: GENERAL PURPOSE CHIP RESISTORS   Source:  Datasheet)
R34  Package: 0402  [RESC1005X40N]  (hidden comment: GENERAL PURPOSE CHIP RESISTORS   Source:  Datasheet)
R35  Package: 0402  [RESC1005X40N]  (hidden comment: GENERAL PURPOSE CHIP RESISTORS   Source:  Datasheet)
R36  Package: 0402  [RESC1005X40N]  (hidden comment: GENERAL PURPOSE CHIP RESISTORS   Source:  Datasheet)
R37  Package: 0402  [RESC1005X40N]  (hidden comment: GENERAL PURPOSE CHIP RESISTORS   Source:  Datasheet)
R38  Package: 0402  [RESC1005X40N]  (hidden comment: GENERAL PURPOSE CHIP RESISTORS   Source:  Datasheet)
R39  Package: 0402  [RESC1005X40N]  (hidden comment: GENERAL PURPOSE CHIP RESISTORS   Source:  Datasheet)
R40  Package: 0402  [RESC1005X40N]  (hidden comment: GENERAL PURPOSE CHIP RESISTORS   Source:  Datasheet)
R41  value 10K  Package: 0402  [RESC1005X40N]  (hidden comment: GENERAL PURPOSE CHIP RESISTORS   Source:  Datasheet)

### Ports
BAT-LDO (bidir), BQ24250-SCL (bidir), BQ24250-SDA (bidir), BQ-INT (bidir), BQ-STAT (bidir), BQ~{-CE} (bidir)

### Nets
5V: R32.2 R41.2  [project net PP_HV1]
GND: C31.2 C33.1 C34.2 C35.2 C36.1 IC8.3(EN2) IC8.4(AGND) IC8.15(PGND_1) IC8.16(PGND_2) IC8.25(EP) R29.1 R31.1 R33.1 R34.1 R35.1 R36.1 R37.1 R38.1 R39.1 R40.1
VBUS: C33.2 IC8.19(IN) R27.2 R28.2
BQ24250-SCL: IC8.6(SCL) R32.1 ; port BQ24250-SCL
BQ24250-SDA: IC8.5(SDA) R41.1 ; port BQ24250-SDA
ILIM: IC8.22(ILIM) R37.2 R38.2 R39.2 R40.2
ISET: IC8.10(ISET) R33.2 R34.2 R35.2 R36.2
LDO: C36.2 IC8.24(LDO) R30.2 ; port BAT-LDO
To BaTT+: C35.1 IC8.11(BAT_1) IC8.12(BAT_2)
To Main System: C34.1 IC8.13(SYS_1) IC8.14(SYS_2) L1.2
TS: IC8.9(TS) R30.1 R31.2
VDPM: IC8.23(VDPM) R27.1 R29.2
NetC31_1: C31.1 IC8.20(PMID)
NetC32_1: C32.1 IC8.17(SW_1) IC8.18(SW_2) L1.1
NetC32_2: C32.2 IC8.21(BOOT)
NetIC8_1: IC8.1(!CE) ; port BQ~{-CE}
NetIC8_2: IC8.2(EN1) R28.1
NetIC8_7: IC8.7(STAT) ; port BQ-STAT
NetIC8_8: IC8.8(INT) ; port BQ-INT

### Notes on the sheet
- Labels drawn without touching a wire or pin: BAT-NTC, BATT+, SYS Mains

### Library data of the parts
C31-C36 = 04025C104KAT2A: Manufacturer_Name: AVX; GateName_1: G$1; SymbolName_1: 04025C104KAT2A; LibraryName: 04025C104KAT2A; DeviceSetName: 04025C104KAT2A; Manufacturer_Part_Number: 04025C104KAT2A; Mouser_Part_Number: 581-04025C104KAT2A; Mouser_Price-Stock: https://www.mouser.co.uk/ProductDetail/AVX/04025C104KAT2A?qs=ZBeOGGPQgEFYcwOskjAIVQ%3D%3D; Arrow_Part_Number: 04025C104KAT2A; Arrow_Price-Stock: https://www.arrow.com/en/products/04025c104kat2a/avx?region=nac; Height: 0.56mm
IC8 = BQ24250RGER: Manufacturer_Name: Texas Instruments; GateName_1: G$1; SymbolName_1: BQ24250RGER; LibraryName: BQ24250RGER; DeviceSetName: BQ24250RGER; Package: QFN50P400X400X100-25N; Manufacturer_Part_Number: BQ24250RGER; Mouser_Part_Number: 595-BQ24250RGER; Mouser_Price-Stock: https://www.mouser.co.uk/ProductDetail/Texas-Instruments/BQ24250RGER?qs=VqERlb%252BKohfBI76g9iGg8g%3D%3D; Arrow_Part_Number: BQ24250RGER; Arrow_Price-Stock: https://www.arrow.com/en/products/bq24250rger/texas-instruments; Height: 1mm
L1 = MCEE1005T1R0MHN: Manufacturer_Name: TAIYO YUDEN; GateName_1: G$1; SymbolName_1: MCEE1005T1R0MHN; LibraryName: MCEE1005T1R0MHN; DeviceSetName: MCEE1005T1R0MHN; Manufacturer_Part_Number: MCEE1005T1R0MHN; Mouser_Part_Number: 963-MCEE1005T1R0MHN; Mouser_Price-Stock: https://www.mouser.co.uk/ProductDetail/Taiyo-Yuden/MCEE1005T1R0MHN?qs=T3oQrply3y%252B0bjhIycfdaQ%3D%3D; Height: 0.55mm
R27-R41 = RC0402FR-071KL: as R1 on sheet TPS65988; SymbolName_1: RC0402FR-071KL; LibraryName: RC0402FR-071KL; DeviceSetName: RC0402FR-071KL; Manufacturer_Part_Number: RC0402FR-071KL; Mouser_Part_Number: 603-RC0402FR-071KL; Mouser_Price-Stock: https://www.mouser.co.uk/ProductDetail/YAGEO/RC0402FR-071KL?qs=V1yeUXFNrknDEmWLmm5v6g%3D%3D; Arrow_Part_Number: RC0402FR-071KL; Arrow_Price-Stock: https://www.arrow.com/en/products/rc0402fr-071kl/yageo?region=nac; Height: 0.4mm
  R27-R31 R33-R40: Value: *

## Sheet 2-50Pin B2B Connector.SchDoc
size A3; SheetNumber: 8; SheetTotal: 8
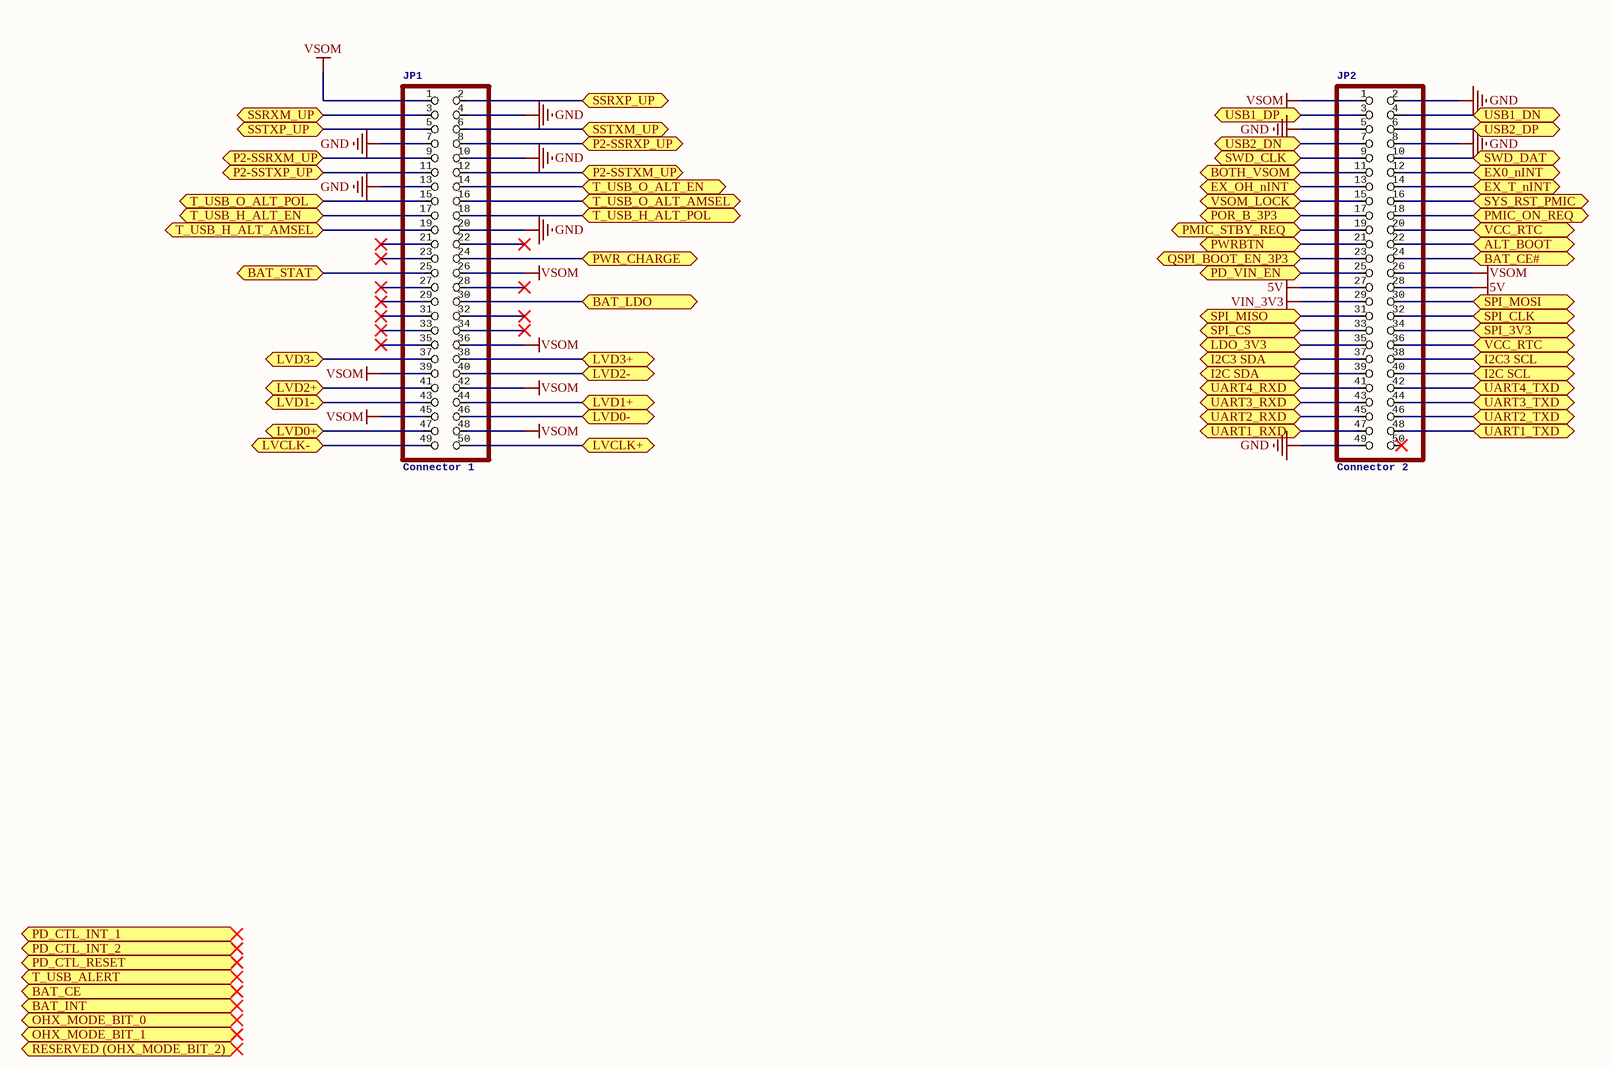
[diagram p8: 2-50Pin B2B Connector.SchDoc]

### Parts
JP1  Connector 1  [2X25]
JP2  Connector 2  [2X25]

### Ports
ALT_BOOT (bidir), BAT_CE (bidir), BAT_CE# (bidir), BAT_INT (bidir), BAT_LDO (bidir), BAT_STAT (bidir), BOTH_VSOM (bidir), EX0_nINT (bidir), EX_OH_nINT (bidir), EX_T_nINT (bidir), I2C3 SCL (bidir), I2C3 SDA (bidir), I2C SCL (bidir), I2C SDA (bidir), LDO_3V3 (bidir), LVCLK+ (bidir), LVCLK- (bidir), LVD0+ (bidir), LVD0- (bidir), LVD1+ (bidir), LVD1- (bidir), LVD2+ (bidir), LVD2- (bidir), LVD3+ (bidir), LVD3- (bidir), OHX_MODE_BIT_0 (bidir), OHX_MODE_BIT_1 (bidir), P2-SSRXM_UP (bidir), P2-SSRXP_UP (bidir), P2-SSTXM_UP (bidir), P2-SSTXP_UP (bidir), PD_CTL_INT_1 (bidir), PD_CTL_INT_2 (bidir), PD_CTL_RESET (bidir), PD_VIN_EN (bidir), PMIC_ON_REQ (bidir), PMIC_STBY_REQ (bidir), POR_B_3P3 (bidir), PWR_CHARGE (bidir), PWRBTN (bidir), QSPI_BOOT_EN_3P3 (bidir), RESERVED (OHX_MODE_BIT_2) (bidir), SPI_3V3 (bidir), SPI_CLK (bidir), SPI_CS (bidir), SPI_MISO (bidir), SPI_MOSI (bidir), SSRXM_UP (bidir), SSRXP_UP (bidir), SSTXM_UP (bidir), SSTXP_UP (bidir), SWD_CLK (bidir), SWD_DAT (bidir), SYS_RST_PMIC (bidir), T_USB_ALERT (bidir), T_USB_H_ALT_AMSEL (bidir), T_USB_H_ALT_EN (bidir), T_USB_H_ALT_POL (bidir), T_USB_O_ALT_AMSEL (bidir), T_USB_O_ALT_EN (bidir), T_USB_O_ALT_POL (bidir), UART1_RXD (bidir), UART1_TXD (bidir), UART2_RXD (bidir), UART2_TXD (bidir), UART3_RXD (bidir), UART3_TXD (bidir), UART4_RXD (bidir), UART4_TXD (bidir), USB1_DN (bidir), USB1_DP (bidir), USB2_DN (bidir), USB2_DP (bidir), VCC_RTC (bidir), VSOM_LOCK (bidir)

### Nets
5V: JP2.27 JP2.28  [project net PP_HV1]
GND: JP1.4 JP1.7 JP1.10 JP1.13 JP1.20 JP2.2 JP2.5 JP2.8 JP2.49
VIN_3V3: JP2.29
VSOM: JP1.1 JP1.26 JP1.36 JP1.39 JP1.42 JP1.45 JP1.48 JP2.1 JP2.26
LDO: JP1.30 ; port BAT_LDO
LVDS_CLK+: JP1.49 ; port LVCLK-
LVDS_CLK-: JP1.50 ; port LVCLK+
LVDS_D0+: JP1.47 ; port LVD0+
LVDS_D0-: JP1.46 ; port LVD0-
LVDS_D1+: JP1.44 ; port LVD1+
LVDS_D1-: JP1.43 ; port LVD1-
LVDS_D2+: JP1.41 ; port LVD2+
LVDS_D2-: JP1.40 ; port LVD2-
LVDS_D3+: JP1.38 ; port LVD3+
LVDS_D3-: JP1.37 ; port LVD3-
NetIC1_40: JP2.9 ; port SWD_CLK
NetIC1_41: JP2.10 ; port SWD_DAT
NetIC2_26: JP1.5 ; port SSTXP_UP
NetIC2_27: JP1.6 ; port SSTXM_UP
NetIC2_29: JP1.2 ; port SSRXP_UP
NetIC2_30: JP1.3 ; port SSRXM_UP
NetIC3_C1: JP2.3 ; port USB1_DP
NetIC3_C2: JP2.4 ; port USB1_DN
NetIC4_C1: JP2.6 ; port USB2_DP
NetIC4_C2: JP2.7 ; port USB2_DN
NetIC7_26: JP1.11 ; port P2-SSTXP_UP
NetIC7_27: JP1.12 ; port P2-SSTXM_UP
NetIC7_29: JP1.8 ; port P2-SSRXP_UP
NetIC7_30: JP1.9 ; port P2-SSRXM_UP
NetIC8_1: JP2.24 ; port BAT_CE#
NetIC8_7: JP1.25 ; port BAT_STAT
NetJP1_14: JP1.14 ; port T_USB_O_ALT_EN
NetJP1_15: JP1.15 ; port T_USB_O_ALT_POL
NetJP1_16: JP1.16 ; port T_USB_O_ALT_AMSEL
NetJP1_17: JP1.17 ; port T_USB_H_ALT_EN
NetJP1_18: JP1.18 ; port T_USB_H_ALT_POL
NetJP1_19: JP1.19 ; port T_USB_H_ALT_AMSEL
NetJP1_24: JP1.24 ; port PWR_CHARGE
NetJP2_11: JP2.11 ; port BOTH_VSOM
NetJP2_12: JP2.12 ; port EX0_nINT
NetJP2_13: JP2.13 ; port EX_OH_nINT
NetJP2_14: JP2.14 ; port EX_T_nINT
NetJP2_15: JP2.15 ; port VSOM_LOCK
NetJP2_16: JP2.16 ; port SYS_RST_PMIC
NetJP2_17: JP2.17 ; port POR_B_3P3
NetJP2_18: JP2.18 ; port PMIC_ON_REQ
NetJP2_19: JP2.19 ; port PMIC_STBY_REQ
NetJP2_20: JP2.20 JP2.36 ; port VCC_RTC
NetJP2_21: JP2.21 ; port PWRBTN
NetJP2_22: JP2.22 ; port ALT_BOOT
NetJP2_23: JP2.23 ; port QSPI_BOOT_EN_3P3
NetJP2_25: JP2.25 ; port PD_VIN_EN
NetJP2_30: JP2.30 ; port SPI_MOSI
NetJP2_31: JP2.31 ; port SPI_MISO
NetJP2_32: JP2.32 ; port SPI_CLK
NetJP2_33: JP2.33 ; port SPI_CS
NetJP2_34: JP2.34 ; port SPI_3V3
NetJP2_35: JP2.35 ; port LDO_3V3
NetJP2_37: JP2.37 ; port I2C3 SDA
NetJP2_38: JP2.38 ; port I2C3 SCL
NetJP2_39: JP2.39 ; port I2C SDA
NetJP2_40: JP2.40 ; port I2C SCL
NetJP2_41: JP2.41 ; port UART4_RXD
NetJP2_42: JP2.42 ; port UART4_TXD
NetJP2_43: JP2.43 ; port UART3_RXD
NetJP2_44: JP2.44 ; port UART3_TXD
NetJP2_45: JP2.45 ; port UART2_RXD
NetJP2_46: JP2.46 ; port UART2_TXD
NetJP2_47: JP2.47 ; port UART1_RXD
NetJP2_48: JP2.48 ; port UART1_TXD

Not connected (* = marked no-connect by the designer): JP1 21* 22* 23* 27* 28* 29* 31* 32* 33* 34* 35*; JP2 50*

### Library data of the parts
JP1 JP2 = PINHD-2X25

## Sheet 45 Pin Connectors.SchDoc
size A4; SheetNumber: 9; SheetTotal: 9
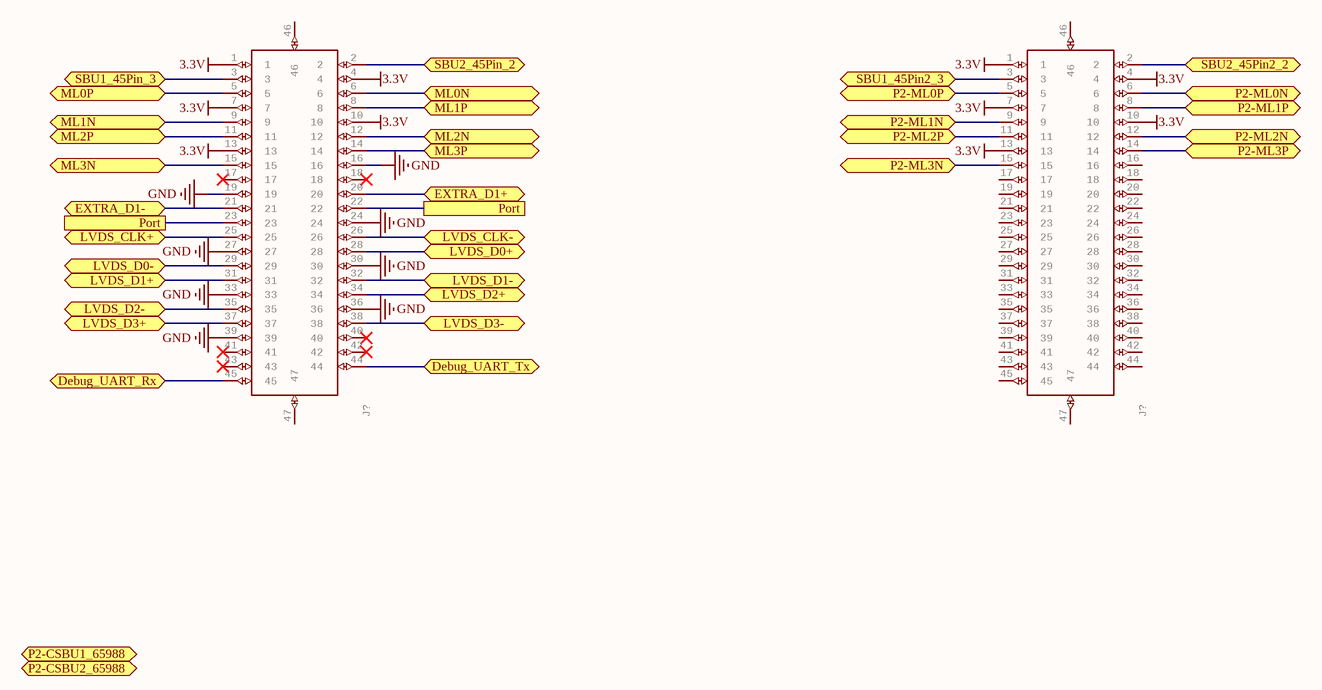
[diagram p9: 45 Pin Connectors.SchDoc]

### Parts
(Parts that share a designator on the sheet are numbered #1, #2 ... from top to bottom, then left to right.)
J?#1  AMP - TE CONNECTIVITY - 4-2328724-5 - CONNECTOR, FPC, R/A, 45POS, 1ROW, 0.3MM   Source:  Datasheet  [423287245]  (value not drawn)
J?#2  AMP - TE CONNECTIVITY - 4-2328724-5 - CONNECTOR, FPC, R/A, 45POS, 1ROW, 0.3MM   Source:  Datasheet  [423287245]  (value not drawn)

### Ports
Debug_UART_Rx (bidir), Debug_UART_Tx (bidir), EXTRA_D1+ (bidir), EXTRA_D1- (bidir), LVDS_CLK+ (bidir), LVDS_CLK- (bidir), LVDS_D0+ (bidir), LVDS_D0- (bidir), LVDS_D1+ (bidir), LVDS_D1- (bidir), LVDS_D2+ (bidir), LVDS_D2- (bidir), LVDS_D3+ (bidir), LVDS_D3- (bidir), ML0N (bidir), ML0P (bidir), ML1N (bidir), ML1P (bidir), ML2N (bidir), ML2P (bidir), ML3N (bidir), ML3P (bidir), P2-CSBU1_65988 (bidir), P2-CSBU2_65988 (bidir), P2-ML0N (bidir), P2-ML0P (bidir), P2-ML1N (bidir), P2-ML1P (bidir), P2-ML2N (bidir), P2-ML2P (bidir), P2-ML3N (bidir), P2-ML3P (bidir), Port, SBU1_45Pin2_3 (bidir), SBU1_45Pin_3 (bidir), SBU2_45Pin2_2 (bidir), SBU2_45Pin_2 (bidir)

### Nets
3.3V: J?#1.1 J?#1.4 J?#1.7 J?#1.10 J?#1.13 J?#2.1 J?#2.4 J?#2.7 J?#2.10 J?#2.13
GND: J?#1.16 J?#1.19 J?#1.24 J?#1.27 J?#1.30 J?#1.33 J?#1.36 J?#1.39
LVDS_CLK+: J?#1.25 ; port LVDS_CLK+
LVDS_CLK-: J?#1.26 ; port LVDS_CLK-
LVDS_D0+: J?#1.28 ; port LVDS_D0+
LVDS_D0-: J?#1.29 ; port LVDS_D0-
LVDS_D1+: J?#1.31 ; port LVDS_D1+
LVDS_D1-: J?#1.32 ; port LVDS_D1-
LVDS_D2+: J?#1.34 ; port LVDS_D2+
LVDS_D2-: J?#1.35 ; port LVDS_D2-
LVDS_D3+: J?#1.37 ; port LVDS_D3+
LVDS_D3-: J?#1.38 ; port LVDS_D3-
P2-ML0N: J?#2.6 ; port P2-ML0N
P2-ML0P: J?#2.5 ; port P2-ML0P
P2-ML1N: J?#2.9 ; port P2-ML1N
P2-ML1P: J?#2.8 ; port P2-ML1P
P2-ML2N: J?#2.12 ; port P2-ML2N
P2-ML2P: J?#2.11 ; port P2-ML2P
P2-ML3N: J?#2.15 ; port P2-ML3N
P2-ML3P: J?#2.14 ; port P2-ML3P
SBU1_45Pin2_3: J?#2.3 ; port SBU1_45Pin2_3
SBU1_460: J?#1.3 ; port SBU1_45Pin_3
SBU2_45Pin2_2: J?#2.2 ; port SBU2_45Pin2_2
SBU2_460: J?#1.2 ; port SBU2_45Pin_2
NetIC2_16: J?#1.9 ; port ML1N
NetIC2_17: J?#1.8 ; port ML1P
NetIC2_19: J?#1.6 ; port ML0N
NetIC2_20: J?#1.5 ; port ML0P
NetIC2_21: J?#1.15 ; port ML3N
NetIC2_22: J?#1.14 ; port ML3P
NetIC2_24: J?#1.12 ; port ML2N
NetIC2_25: J?#1.11 ; port ML2P
NetIC3_C3: J?#1.20 ; port EXTRA_D1+
NetIC3_C4: J?#1.21 ; port EXTRA_D1-
NetJ?#1_22: J?#1.22 J?#1.23 ; port Port
NetJ?#1_44: J?#1.44 ; port Debug_UART_Tx
NetJ?#1_45: J?#1.45 ; port Debug_UART_Rx

Not connected (* = marked no-connect by the designer): J?#1 17* 18* 40* 41* 42* 43* 46 47; J?#2 16 17 18 19 20 21 22 23 24 25 26 27 28 29 30 31 32 33 34 35 36 37 38 39 40 41 42 43 44 45 46 47

### Library data of the parts
J?#1 J?#2 = 4-2328724-5: GateName_1: G$1; SymbolName_1: 4-2328724-5; LibraryName: 4-2328724-5; DeviceSetName: 4-2328724-5; Package: 423287245; Manufacturer_Name: TE Connectivity; Manufacturer_Part_Number: 4-2328724-5; Mouser_Part_Number: 571-4-2328724-5; Mouser_Price-Stock: https://www.mouser.co.uk/ProductDetail/TE-Connectivity/4-2328724-5?qs=w%2Fv1CP2dgqow3y3efq3sig%3D%3D; Arrow_Part_Number: 4-2328724-5; Arrow_Price-Stock: https://www.arrow.com/en/products/4-2328724-5/te-connectivity; Height: 1.1mm